# Altium project rt10-r2.PrjPcb (part 1 of 2)
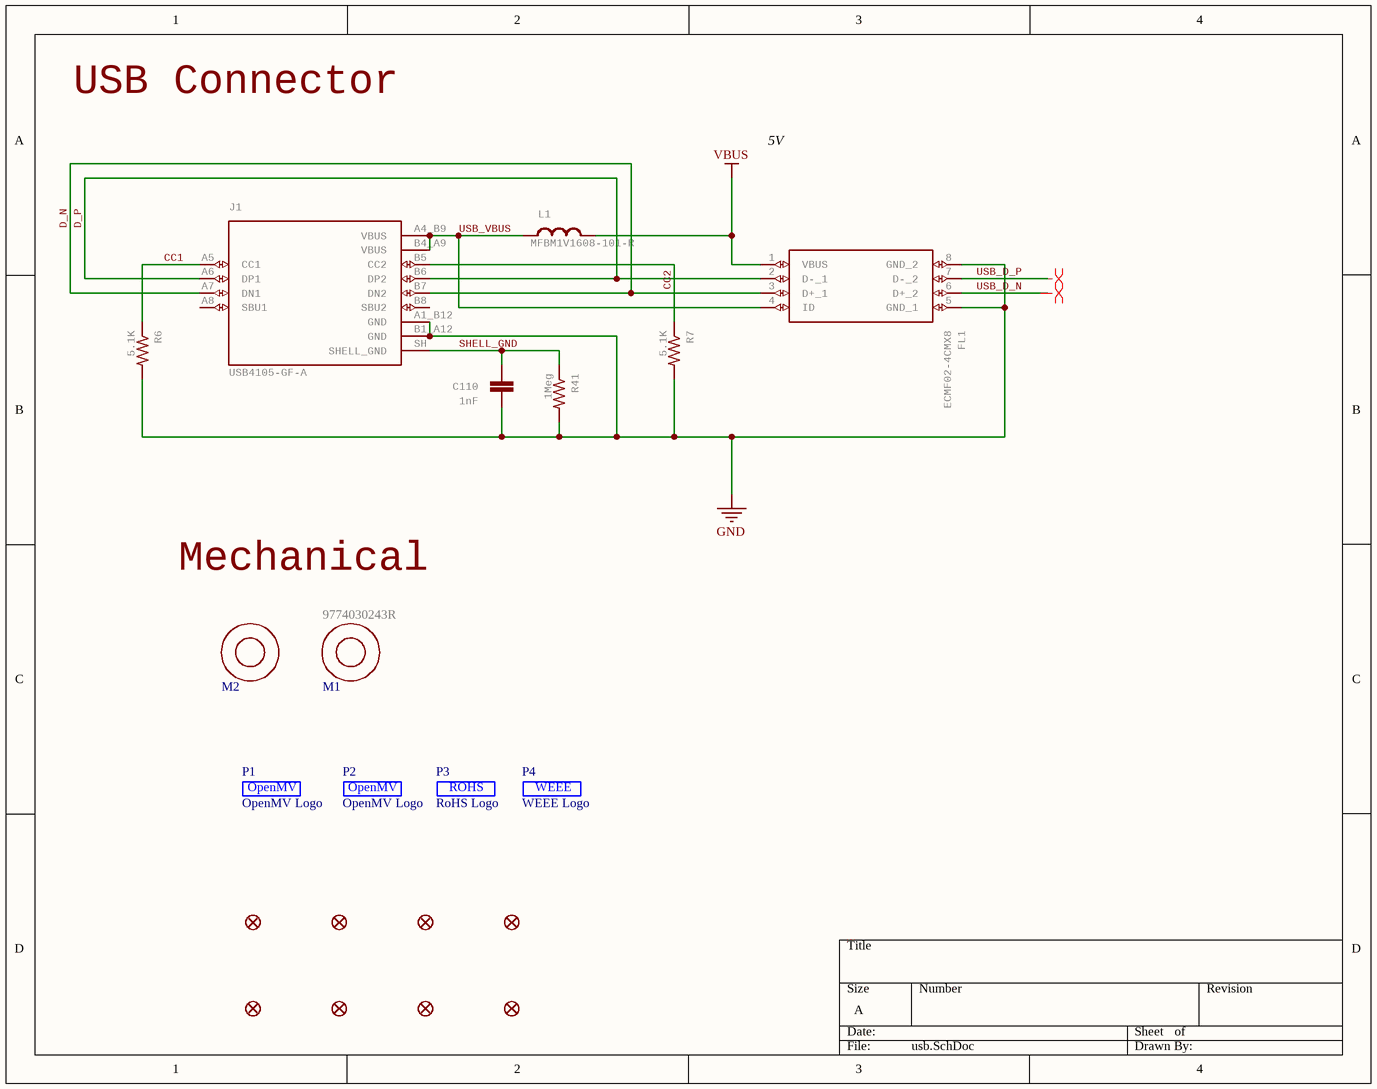
[diagram p0: usb.SchDoc]
14 sheets, 256 parts. Net scope: global (net labels, ports and power ports of the same name join across sheets).
Board file: rt10-r2.PcbDoc
Sheets:
  usb.SchDoc
  ideal-diode.SchDoc
  battery-charging.SchDoc
  regulators.SchDoc
  sdram-16-bit.SchDoc
  qspi-flash.SchDoc
  security-accelerometer.SchDoc
  sd-card.SchDoc
  sensor-header.SchDoc
  io-headers.SchDoc
  jtag.SchDoc
  ethernet.SchDoc
  wifi-bt.SchDoc
  mimxrt10xx.SchDoc

## Sheet usb.SchDoc
size A

### Parts
C110  1nF  [0402-CAP]
FD1  FIDUCIAL1X2  [FIDUCIAL-1X2]  (value not drawn)
FD2  FIDUCIAL1X2  [FIDUCIAL-1X2]  (value not drawn)
FD3  FIDUCIAL1X2  [FIDUCIAL-1X2]  (value not drawn)
FD4  FIDUCIAL1X2  [FIDUCIAL-1X2]  (value not drawn)
FD5  FIDUCIAL1X2  [FIDUCIAL-1X2]  (value not drawn)
FD6  FIDUCIAL1X2  [FIDUCIAL-1X2]  (value not drawn)
FD7  FIDUCIAL1X2  [FIDUCIAL-1X2]  (value not drawn)
FD8  FIDUCIAL1X2  [FIDUCIAL-1X2]  (value not drawn)
FL1  ECMF02-4CMX8  [ECMF024CMX8]
J1  USB4105-GF-A  [GCT_USB4105-GF-A]
L1  MFBM1V1608-101-R  [0603-RES]
M1  9774030243R  [9774030243R]
M2  9774030243R  [9774030243R]  (value not drawn)
P1  OpenMV Logo  [OMV-LOGO-SMALL]  (no BOM)
P2  OpenMV Logo  [OMV-LOGO-SMALL]  (no BOM)
P3  RoHS Logo  [ROHS]  (no BOM)
P4  WEEE Logo  [WEEE]  (no BOM)
R6  5.1K  [0402-RES]
R7  5.1K  [0402-RES]
R41  1Meg  [0402-RES]

### Nets
GND: C110.2 FL1.5(GND_1) FL1.8(GND_2) J1.A1_B12(GND) J1.B1_A12(GND) R6.2 R7.2 R41.2
VBUS: FL1.1(VBUS) L1.2
CC1: J1.A5(CC1) R6.1
CC2: J1.B5(CC2) R7.1
D_N: FL1.3(D+_1) J1.A7(DN1) J1.B7(DN2)
D_P: FL1.2(D-_1) J1.A6(DP1) J1.B6(DP2)
SHELL_GND: C110.1 J1.SH(SHELL_GND) R41.1
USB_D_N: FL1.6(D+_2)
USB_D_P: FL1.7(D-_2)
USB_VBUS: FL1.4(ID) J1.A4_B9(VBUS) J1.B4_A9(VBUS) L1.1

Not connected (* = marked no-connect by the designer): J1 A8(SBU1) B8(SBU2)

### Layout directives
differential pair: USB_D_N, USB_D_P

### Notes on the sheet
- USB Connector
- 5V
- Mechanical
- (in symbol OMV) OpenMV

### Library data of the parts
C110 = CAP0402-CAP: Capacitor; MPN: VJ0402Y102JXACW1BC; GateName_1: G$1; SymbolName_1: CAP; DeviceName: 0402-CAP; LibraryName: sfe; DeviceSetName: CAP; Part Number: VJ0402Y102JXACW1BC
FD1-FD8 = FIDUCIAL1X2: Fiducial Alignment Points    Point-of-reference for pick-and-place machines and other optical instruments.; GateName_1: G$1; DeviceName: 1X2; SymbolName_1: FIDUCIAL; LibraryName: SparkFun-Aesthetics; DeviceSetName: FIDUCIAL
FL1 = ECMF02-4CMX8: Common Mode Filter & ESD Prot. USB uQFN8 STMicroelectronics ECMF02 Series, Signal Filter uQFN SMD, Flat Contact Termination, 2.6 x 1.3 x 0.6mm   Source:  Datasheet; GateName_1: G$1; SymbolName_1: ECMF02-4CMX8; LibraryName: ECMF02-4CMX8; DeviceSetName: ECMF02-4CMX8; HEIGHT: mm; MANUFACTURER_NAME: STMicroelectronics; MANUFACTURER_PART_NUMBER: ECMF02-4CMX8; MOUSER_PART_NUMBER: 511-ECMF02-4CMX8; MOUSER_PRICE-STOCK: https://www.mouser.co.uk/ProductDetail/STMicroelectronics/ECMF02-4CMX8?qs=xYt8xtm2zhmK7GoDlDZR3A%3D%3D; MPN: ECMF02-4CMX8; Part Number: ECMF02-4CMX8
J1 = USB4105-GF-A: USB-C (USB TYPE-C) USB 2.0 Receptacle Connector 24 (16+8 Dummy) Position Surface Mount, Right Angle; Through Hole  Check availability; GateName_1: G$1; MF: GCT; SymbolName_1: USB4105-GF-A; LibraryName: USB4105-GF-A; DeviceSetName: USB4105-GF-A; AVAILABILITY: In Stock; MP: USB4105-GF-A; MPN: USB4105-GF-A; PACKAGE: None; PRICE: None; PURCHASE-URL: https://pricing.snapeda.com/search/part/USB4105-GF-A/?ref=eda; Part Number: USB4105-GF-A
L1 = INDUCTOR: InductorsBasic Inductor/Choke - 0603 and 1206. Footprints are not proven and vary greatly between part numbers.; GateName_1: G$1; MPN: MFBM1V1608-101-R; Part Number: MFBM1V1608-101-R
M1 M2 = 9774030243R: M2 3mm Standoff; GateName_1: G$1; SymbolName_1: 9774030243R; LibraryName: 9774030243R; DeviceSetName: 9774030243R; MPN: 9774030243R; Part Number: 9774030243R
P1 P2 = OMV
P3 = ROHS
P4 = WEEE
R6 R7 = RESISTOR0402-RES: ResistorBasic schematic elements and footprints for 0603, 1206, and PTH resistors.; MPN: RC0402JR-075K1L; GateName_1: G$1; SymbolName_1: RESISTOR; DeviceName: 0402-RES; LibraryName: sfe; DeviceSetName: RESISTOR; Part Number: RC0402JR-075K1L
R41 = RESISTOR0402-RES: Resistor; MPN: CRCW04021M00FKEDC; GateName_1: G$1; SymbolName_1: RESISTOR; DeviceName: 0402-RES; LibraryName: sfe; DeviceSetName: RESISTOR; Part Number: CRCW04021M00FKEDC

## Sheet ideal-diode.SchDoc
size A
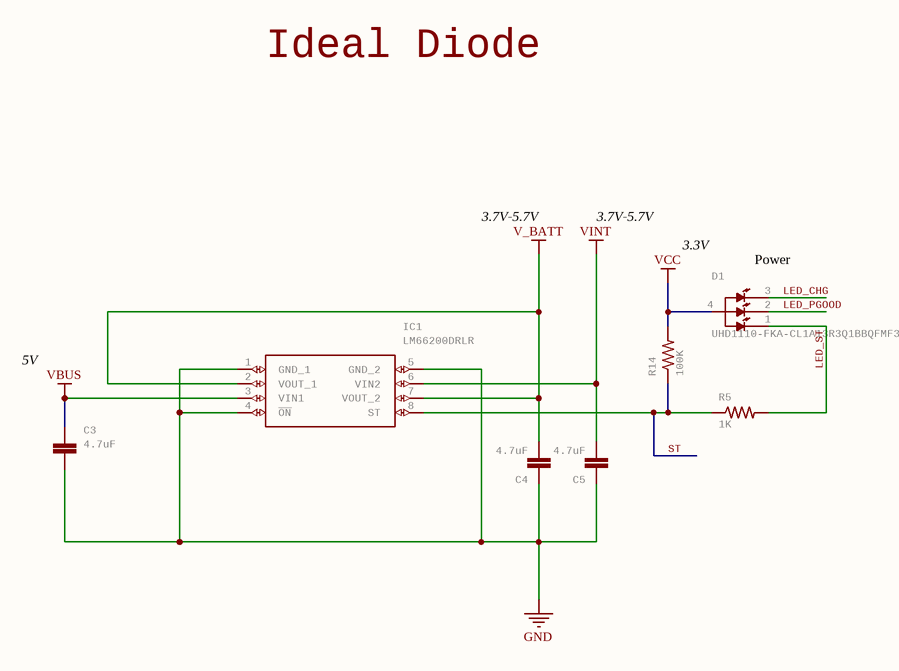
[diagram p1: ideal-diode.SchDoc]

### Parts
C3  4.7uF  [0402-CAP]
C4  4.7uF  [0402-CAP]
C5  4.7uF  [0402-CAP]
D1  UHD1110-FKA-CL1A13R3Q1BBQFMF3  [LED_UHD1110-FKA-CL1A13R3Q1BBQFMF3]
IC1  LM66200DRLR  [SOTFL50P160X60-8N]
R5  1K  [0402-RES]
R14  100K  [0402-RES]

### Nets
GND: C3.1 C4.1 C5.1 IC1.1(GND_1) IC1.4(~{ON}) IC1.5(GND_2)
V_BATT: C4.2 IC1.2(VOUT_1) IC1.7(VOUT_2)
VBUS: C3.2 IC1.3(VIN1)
VCC: D1.4(ANODE) R14.2
VINT: C5.2 IC1.6(VIN2)
LED_CHG: D1.3(RED)
LED_PGOOD: D1.2(GREEN)
LED_ST: D1.1(BLUE) R5.2
ST: IC1.8(ST) R5.1 R14.1

### Notes on the sheet
- Ideal Diode
- 3.7V-5.7V
- (near D1) 3.3V
- (near D1) Power
- 5V

### Library data of the parts
C3-C5 = CAP0402-CAP: CapacitorStandard 0603 ceramic capacitor, and 0.1" leaded capacitor.; MPN: JMK105BBJ475MV-F; GateName_1: G$1; SymbolName_1: CAP; DeviceName: 0402-CAP; LibraryName: sfe; DeviceSetName: CAP; Part Number: JMK105BBJ475MV-F
D1 = UHD1110-FKA-CL1A13R3Q1BBQFMF3: LED RGB SMD, SIZE 1 X 1 mm Check availability; GateName_1: G$1; MF: Cree Inc.; SymbolName_1: UHD1110-FKA-CL1A13R3Q1BBQFMF3; LibraryName: UHD1110-FKA-CL1A13R3Q1BBQFMF3; DeviceSetName: UHD1110-FKA-CL1A13R3Q1BBQFMF3; AVAILABILITY: In Stock; MP: UHD1110-FKA-CL1A13R3Q1BBQFMF3; MPN: UHD1110-FKA-CL1A13r3q1BBQFMF3; PACKAGE: 0404 Cree Inc.; PRICE: None; PURCHASE-URL: https://pricing.snapeda.com/search/part/UHD1110-FKA-CL1A13R3Q1BBQFMF3/?ref=eda; Part Number: UHD1110-FKA-CL1A13r3q1BBQFMF3
IC1 = LM66200DRLR: 1.6-V to 5.5-V, 40-m, 2.5-A, low-IQ, dual ideal diode   Source:  Datasheet; MANUFACTURER_NAME: Texas Instruments; GateName_1: G$1; SymbolName_1: LM66200DRLR; LibraryName: LM66200DRLR; DeviceSetName: LM66200DRLR; HEIGHT: 0.6mm; MANUFACTURER_PART_NUMBER: LM66200DRLR; MOUSER_PART_NUMBER: 595-LM66200DRLR; MOUSER_PRICE-STOCK: https://www.mouser.co.uk/ProductDetail/Texas-Instruments/LM66200DRLR?qs=Rp5uXu7WBW90hnpZAkIOdQ%3D%3D; MPN: LM66200DRLR; Part Number: LM66200DRLR
R5 = RESISTOR0402-RES: ResistorBasic schematic elements and footprints for 0603, 1206, and PTH resistors.; MPN: CRCW04021K00FKEDC; GateName_1: G$1; SymbolName_1: RESISTOR; DeviceName: 0402-RES; LibraryName: sfe; DeviceSetName: RESISTOR; Part Number: CRCW04021K00FKEDC
R14 = RESISTOR0402-RES: ResistorBasic schematic elements and footprints for 0603, 1206, and PTH resistors.; MPN: AC0402FR-07100KL; GateName_1: G$1; SymbolName_1: RESISTOR; DeviceName: 0402-RES; LibraryName: sfe; DeviceSetName: RESISTOR; Part Number: AC0402FR-07100KL

## Sheet battery-charging.SchDoc
size A
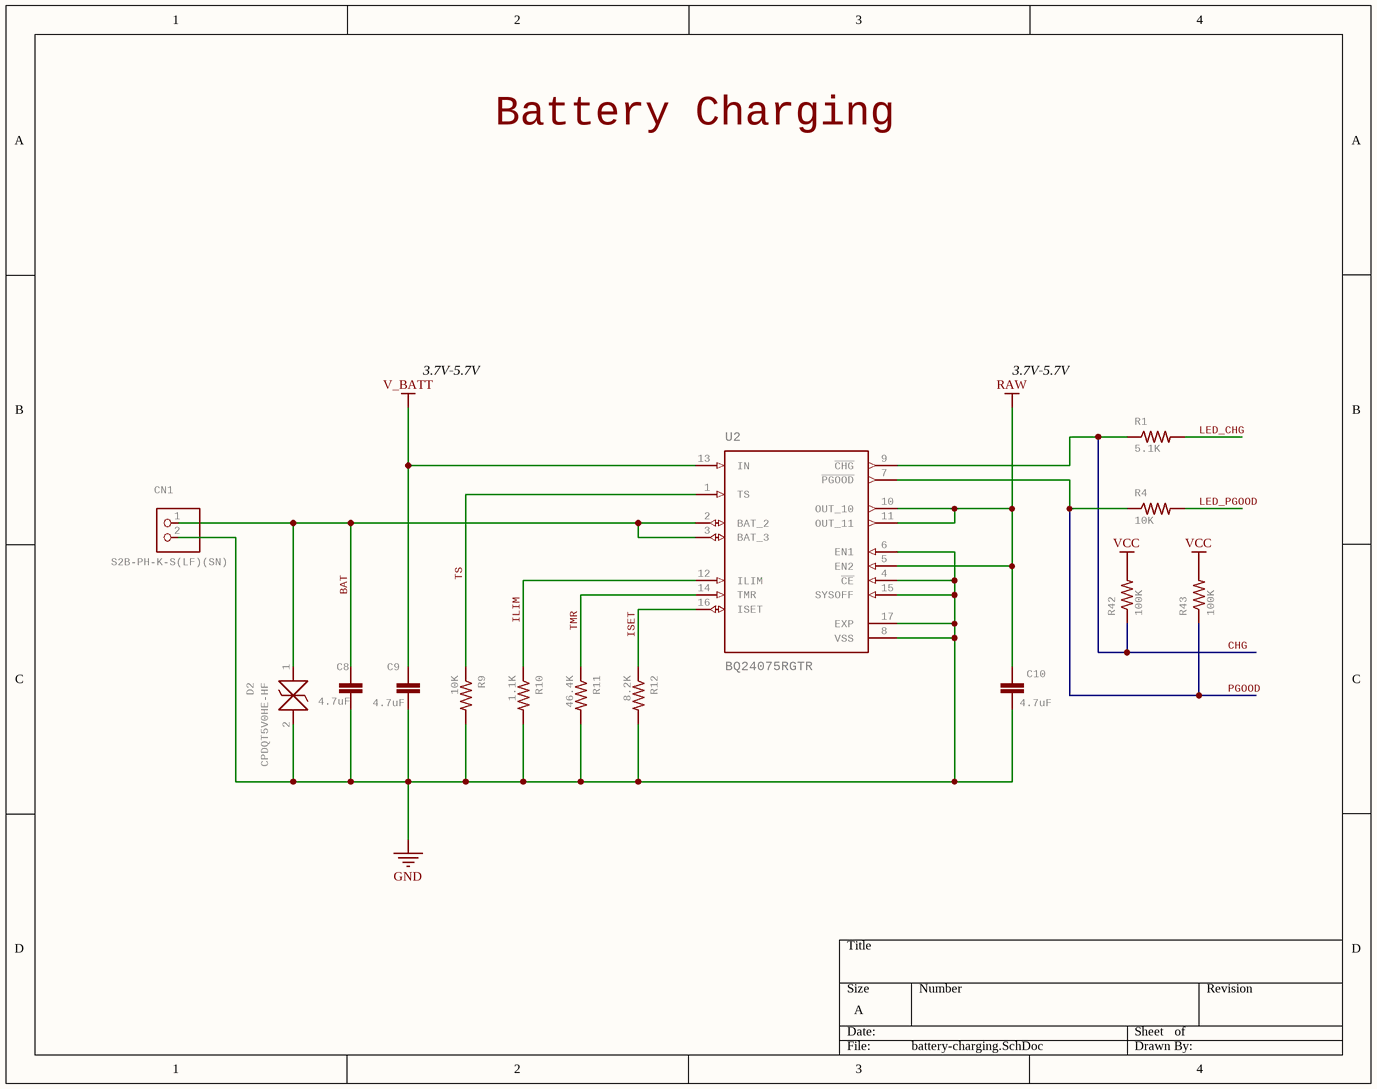
[diagram p2: battery-charging.SchDoc]

### Parts
C8  4.7uF  [0402-CAP]
C9  4.7uF  [0402-CAP]
C10  4.7uF  [0402-CAP]
CN1  S2B-PH-K-S(LF)(SN)  [JST-PH-2-THM-RA]
D2  CPDQT5V0HE-HF  [CPDQT5V0HEHF]
R1  5.1K  [0402-RES]
R4  10K  [0402-RES]
R9  10K  [0402-RES]
R10  1.1K  [0402-RES]
R11  46.4K  [0402-RES]
R12  8.2K  [0402-RES]
R42  100K  [0402-RES]
R43  100K  [0402-RES]
U2  BQ24075RGTR  [QFN50P300X300X100-17N]

### Nets
GND: C8.1 C9.1 C10.1 CN1.2 D2.2 R9.2 R10.2 R11.2 R12.2 U2.4(~{CE}) U2.6(EN1) U2.8(VSS) U2.15(SYSOFF) U2.17(EXP)
RAW: C10.2 U2.5(EN2) U2.10(OUT_10) U2.11(OUT_11)
V_BATT: C9.2 U2.13(IN)
VCC: R42.2 R43.2
BAT: C8.2 CN1.1 D2.1 U2.2(BAT_2) U2.3(BAT_3)
CHG: R1.1 R42.1 U2.9(~{CHG})
ILIM: R10.1 U2.12(ILIM)
ISET: R12.1 U2.16(ISET)
LED_CHG: R1.2
LED_PGOOD: R4.2
PGOOD: R4.1 R43.1 U2.7(~{PGOOD})
TMR: R11.1 U2.14(TMR)
TS: R9.1 U2.1(TS)

### Notes on the sheet
- Battery Charging
- 3.7V-5.7V

### Library data of the parts
C8-C10 = CAP0402-CAP: as C3 on sheet ideal-diode; DeviceName: 0402-CAP; LibraryName: sfe; DeviceSetName: CAP; Part Number: JMK105BBJ475MV-F
CN1 = JST_2PIN-THM-RA: JST 2-Pin Connectors of various flavors SMT-RA (S2B-PH-SM4) 4UConnector #17311  SMT  (B2B-PH-SM4)  THM-RA (S2B-PH)  THM  (B2B-PH); GateName_1: G$1; SymbolName_1: PINHD2; DeviceName: -THM-RA; LibraryName: adafruit-updated; DeviceSetName: JST_2PIN; MPN: S2B-PH-K-S(LF)(SN); Part Number: S2B-PH-K-S(LF)(SN)
D2 = CPDQT5V0HE-HF: ESD Suppressors / TVS Diodes DIODE ESD 5VWM 65W 0402/SOD-923F   Source:  Datasheet; MANUFACTURER_NAME: Comchip Technology; GateName_1: G$1; SymbolName_1: CPDQT5V0HE-HF; LibraryName: CPDQT5V0HE-HF; DeviceSetName: CPDQT5V0HE-HF; HEIGHT: 0.42mm; MANUFACTURER_PART_NUMBER: CPDQT5V0HE-HF; MOUSER_PART_NUMBER: MOUSER_PART_NUMBER; MOUSER_PRICE-STOCK: MOUSER_PRICE-STOCK; MPN: CPDQT5V0HE-HF; Part Number: CPDQT5V0HE-HF
R1 = RESISTOR0402-RES: as R6 on sheet usb; SymbolName_1: RESISTOR; DeviceName: 0402-RES; LibraryName: sfe; DeviceSetName: RESISTOR; Part Number: RC0402JR-075K1L
R4 R9 = RESISTOR0402-RES: ResistorBasic schematic elements and footprints for 0603, 1206, and PTH resistors.; MPN: AC0402FR-1310KL; GateName_1: G$1; SymbolName_1: RESISTOR; DeviceName: 0402-RES; LibraryName: sfe; DeviceSetName: RESISTOR; Part Number: AC0402FR-1310KL
R10 = RESISTOR0402-RES: ResistorBasic schematic elements and footprints for 0603, 1206, and PTH resistors.; MPN: RC0402JR-071K1; GateName_1: G$1; SymbolName_1: RESISTOR; DeviceName: 0402-RES; LibraryName: sfe; DeviceSetName: RESISTOR; Part Number: RC0402JR-071K1
R11 = RESISTOR0402-RES: ResistorBasic schematic elements and footprints for 0603, 1206, and PTH resistors.; MPN: WR04X4642FTL; GateName_1: G$1; SymbolName_1: RESISTOR; DeviceName: 0402-RES; LibraryName: sfe; DeviceSetName: RESISTOR; Part Number: WR04X4642FTL
R12 = RESISTOR0402-RES: ResistorBasic schematic elements and footprints for 0603, 1206, and PTH resistors.; MPN: CR0402-FX-8201GLF; GateName_1: G$1; SymbolName_1: RESISTOR; DeviceName: 0402-RES; LibraryName: sfe; DeviceSetName: RESISTOR; Part Number: CR0402-FX-8201GLF
R42 R43 = RESISTOR0402-RES: as R14 on sheet ideal-diode; SymbolName_1: RESISTOR; DeviceName: 0402-RES; LibraryName: sfe; DeviceSetName: RESISTOR; Part Number: AC0402FR-07100KL
U2 = BQ24075RGTR: Standalone 1-cell 1.5-A linear charger, Power Path, 4.2-V VBAT and 5.5-V VOUT 16-VQFN -40 to 85  Check availability; GateName_1: G$1; MF: Texas Instruments; SymbolName_1: BQ24075RGTR; LibraryName: BQ24075RGTR; DeviceSetName: BQ24075RGTR; AVAILABILITY: In Stock; MP: BQ24075RGTR; MPN: BQ24075RGTR; PACKAGE: VQFN-16 Texas Instruments; PRICE: None; PURCHASE-URL: https://pricing.snapeda.com/search/part/BQ24075RGTR/?ref=eda; Part Number: BQ24075RGTR

## Sheet regulators.SchDoc
size A
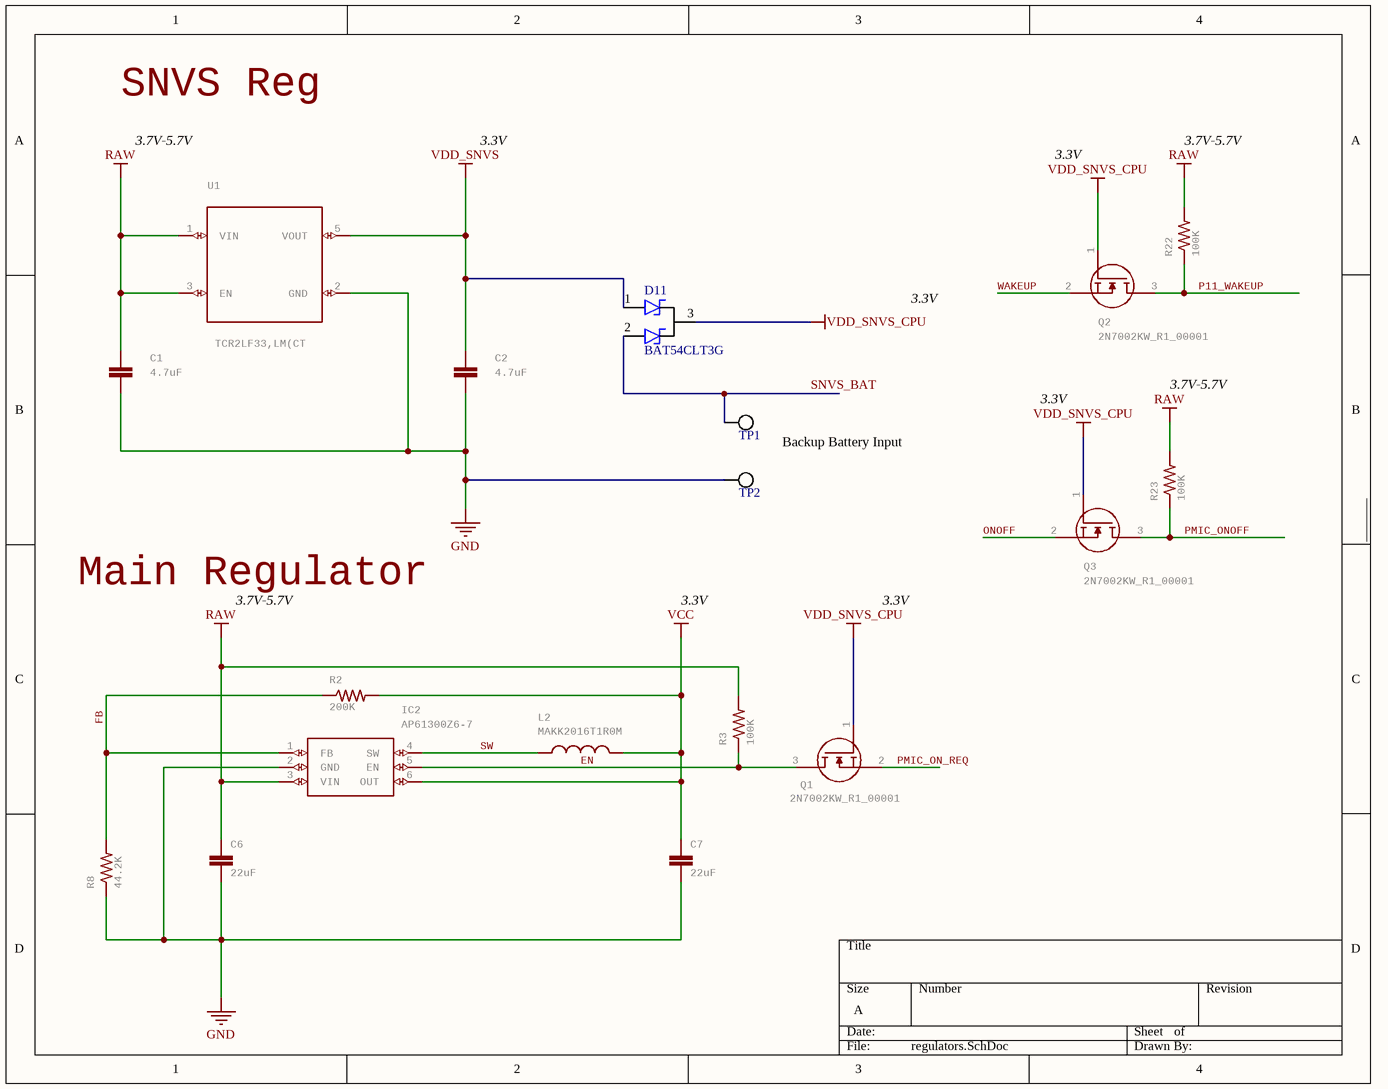
[diagram p3: regulators.SchDoc]

### Parts
C1  4.7uF  [0402-CAP]
C2  4.7uF  [0402-CAP]
C6  22uF  [0805]
C7  22uF  [0805]
D11  MPN: BAT54CLT3G  [SOT-23-3]  (hidden comment: Dual Schottky)
IC2  AP61300Z6-7  [SOTFL50P162X60-6N]
L2  MAKK2016T1R0M  [INDC2016X100N]
Q1  2N7002KW_R1_00001  [SOT65P210X110-3N]
Q2  2N7002KW_R1_00001  [SOT65P210X110-3N]
Q3  2N7002KW_R1_00001  [SOT65P210X110-3N]
R2  200K  [0402-RES]
R3  100K  [0402-RES]
R8  44.2K  [0402-RES]
R22  100K  [0402-RES]
R23  100K  [0402-RES]
TP1  TP  [TP_1p8]  (value not drawn)  (no BOM)
TP2  TP  [TP_1p8]  (value not drawn)  (no BOM)
U1  TCR2LF33,LM(CT  [SOT-23-5]

### Nets
GND: C1.1 C2.1 C6.2 C7.2 IC2.2(GND) R8.1 TP2.1 U1.2(GND)
RAW: C1.2 C6.1 IC2.3(VIN) R3.2 R22.2 R23.2 U1.1(VIN) U1.3(EN)
VCC: C7.1 IC2.6(OUT) L2.2 R2.2
VDD_SNVS: C2.2 D11.1 U1.5(VOUT)
VDD_SNVS_CPU: D11.3 Q1.1(G) Q2.1(G) Q3.1(G)
EN: IC2.5(EN) Q1.3(D) R3.1
FB: IC2.1(FB) R2.1 R8.2
ONOFF: Q3.2(S)
P11_WAKEUP: Q2.3(D) R22.1
PMIC_ON_REQ: Q1.2(S)
PMIC_ONOFF: Q3.3(D) R23.1
SNVS_BAT: D11.2 TP1.1
SW: IC2.4(SW) L2.1
WAKEUP: Q2.2(S)

### Notes on the sheet
- SNVS Reg
- 3.7V-5.7V
- 3.3V
- Backup Battery Input
- Main Regulator

### Library data of the parts
C1 C2 = CAP0402-CAP: as C3 on sheet ideal-diode; DeviceName: 0402-CAP; LibraryName: sfe; DeviceSetName: CAP; Part Number: JMK105BBJ475MV-F
C6 C7 = 22UF-0805-6.3V-20%: 22ÂµF ceramic capacitors    A capacitor is a passive two-terminal electrical component used to store electrical energy temporarily in an electric field.; MPN: CL21A226MQQNNNE; GateName_1: G$1; SymbolName_1: CAP; PROD_ID: CAP-08402; DeviceName: -0805-6.3V-20%; LibraryName: SparkFun-Capacitors; DeviceSetName: 22UF; Part Number: CL21A226MQQNNNE
D11 = Dual Schottky: Value: ?V; Part Number: BAT54CLT3G
IC2 = AP61300Z6-7: DCDC Conv LV Buck SOT563 T&R 3K   Source:  Datasheet; MANUFACTURER_NAME: Diodes Inc.; GateName_1: G$1; SymbolName_1: AP61300Z6-7; LibraryName: AP61300Z6-7; DeviceSetName: AP61300Z6-7; HEIGHT: 0.6mm; MANUFACTURER_PART_NUMBER: AP61300Z6-7; MOUSER_PART_NUMBER: 621-AP61300Z6-7; MOUSER_PRICE-STOCK: https://www.mouser.co.uk/ProductDetail/Diodes-Incorporated/AP61300Z6-7?qs=HBWAp0VN4Ri0dzb0XP2pEA%3D%3D; MPN: AP61300Z6-7; Part Number: AP61300Z6-7
L2 = MAKK2016T1R0M: Ind Power Wirewound 1uH 20% 2MHz Metal 2200mA 0806 Check availability; GateName_1: G$1; MF: Taiyo Yuden; SymbolName_1: MAKK2016T1R0M; LibraryName: MAKK2016T1R0M; DeviceSetName: MAKK2016T1R0M; AVAILABILITY: In Stock; MP: MAKK2016T1R0M; MPN: MAKK2016T1R0M; PACKAGE: 2016 Taiyo Yuden; PRICE: None; PURCHASE-URL: https://pricing.snapeda.com/search/part/MAKK2016T1R0M/?ref=eda; Part Number: MAKK2016T1R0M
Q1-Q3 = 2N7002KW_R1_00001: MOSFET 60V N-Channel Enhancement Mode MOSFET - ESD Protected   Source:  Datasheet; MANUFACTURER_NAME: PANJIT; GateName_1: G$1; SymbolName_1: 2N7002KW_R1_00001; LibraryName: 2N7002KW_R1_00001; DeviceSetName: 2N7002KW_R1_00001; HEIGHT: 1.1mm; MANUFACTURER_PART_NUMBER: 2N7002KW_R1_00001; MOUSER_PART_NUMBER: 241-2N7002KWR100001; MOUSER_PRICE-STOCK: https://www.mouser.co.uk/ProductDetail/Panjit/2N7002KW_R1_00001?qs=sPbYRqrBIVliWKATqv7jNA%3D%3D; MPN: 2N7002KW_R1_00001; Part Number: 2N7002KW_R1_00001
R2 = RESISTOR0402-RES: ResistorBasic schematic elements and footprints for 0603, 1206, and PTH resistors.; MPN: CRCW0402200KFKEDC; GateName_1: G$1; SymbolName_1: RESISTOR; DeviceName: 0402-RES; LibraryName: sfe; DeviceSetName: RESISTOR; Part Number: CRCW0402200KFKEDC
R3 R22 R23 = RESISTOR0402-RES: as R14 on sheet ideal-diode; SymbolName_1: RESISTOR; DeviceName: 0402-RES; LibraryName: sfe; DeviceSetName: RESISTOR; Part Number: AC0402FR-07100KL
R8 = RESISTOR0402-RES: ResistorBasic schematic elements and footprints for 0603, 1206, and PTH resistors.; MPN: AC0402FR-0744K2L; GateName_1: G$1; SymbolName_1: RESISTOR; DeviceName: 0402-RES; LibraryName: sfe; DeviceSetName: RESISTOR; Part Number: AC0402FR-0744K2L
U1 = TCR2LF33,LM(CT: GateName_1: G$1; SymbolName_1: TCR2LF33,LM(CT; LibraryName: TCR2LF33,LM(CT; DeviceSetName: TCR2LF33,LM(CT; MPN: TCR2LF33,LM(CT

## Sheet sdram-16-bit.SchDoc
size A
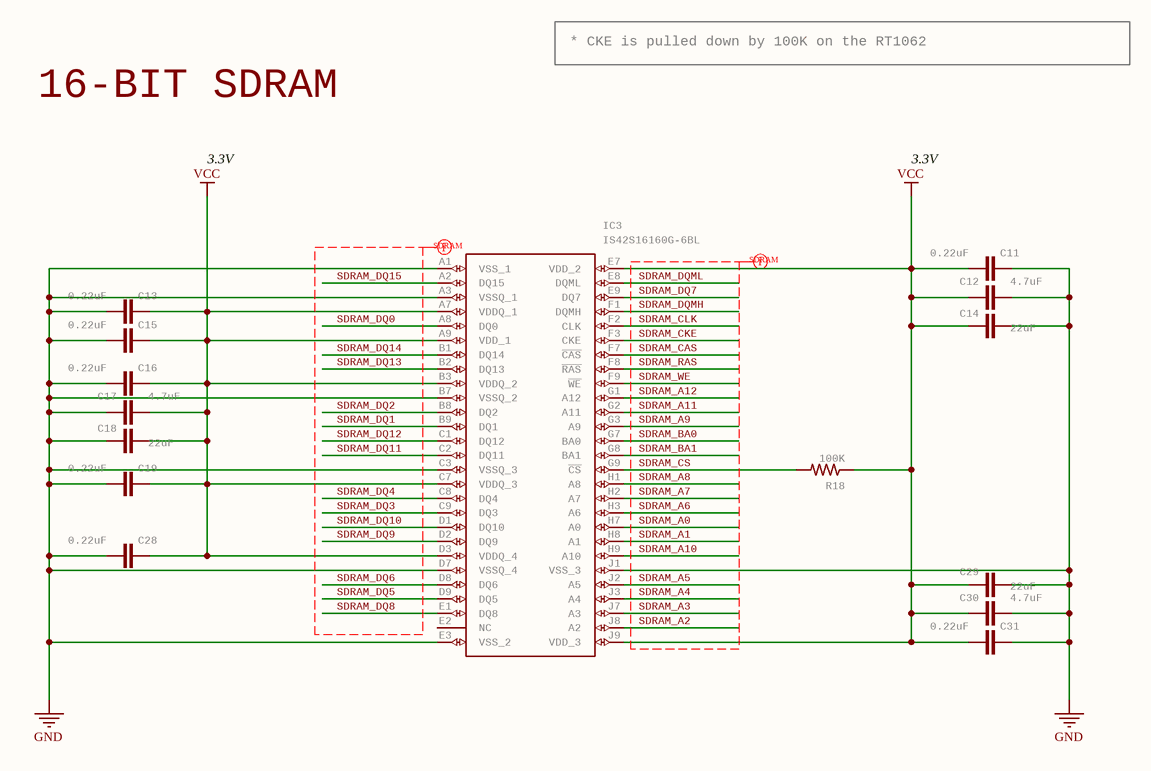
[diagram p4: sdram-16-bit.SchDoc]

### Parts
C11  0.22uF  [C0201]
C12  4.7uF  [0402-CAP]
C13  0.22uF  [C0201]
C14  22uF  [0805]
C15  0.22uF  [C0201]
C16  0.22uF  [C0201]
C17  4.7uF  [0402-CAP]
C18  22uF  [0805]
C19  0.22uF  [C0201]
C28  0.22uF  [C0201]
C29  22uF  [0805]
C30  4.7uF  [0402-CAP]
C31  0.22uF  [C0201]
IC3  IS42S16160G-6BL  [BGA54C80P9X9_800X800X120]
R18  100K  [0402-RES]

### Nets
GND: C11.1 C12.2 C13.2 C14.2 C15.2 C16.2 C17.1 C18.1 C19.2 C28.2 C29.2 C30.2 C31.1 IC3.A1(VSS_1) IC3.A3(VSSQ_1) IC3.B7(VSSQ_2) IC3.C3(VSSQ_3) IC3.D7(VSSQ_4) IC3.E3(VSS_2) IC3.J1(VSS_3)
VCC: C11.2 C12.1 C13.1 C14.1 C15.1 C16.1 C17.2 C18.2 C19.1 C28.1 C29.1 C30.1 C31.2 IC3.A7(VDDQ_1) IC3.A9(VDD_1) IC3.B3(VDDQ_2) IC3.C7(VDDQ_3) IC3.D3(VDDQ_4) IC3.E7(VDD_2) IC3.J9(VDD_3) R18.1
SDRAM_A0: IC3.H7(A0)
SDRAM_A1: IC3.H8(A1)
SDRAM_A2: IC3.J8(A2)
SDRAM_A3: IC3.J7(A3)
SDRAM_A4: IC3.J3(A4)
SDRAM_A5: IC3.J2(A5)
SDRAM_A6: IC3.H3(A6)
SDRAM_A7: IC3.H2(A7)
SDRAM_A8: IC3.H1(A8)
SDRAM_A9: IC3.G3(A9)
SDRAM_A10: IC3.H9(A10)
SDRAM_A11: IC3.G2(A11)
SDRAM_A12: IC3.G1(A12)
SDRAM_BA0: IC3.G7(BA0)
SDRAM_BA1: IC3.G8(BA1)
SDRAM_CAS: IC3.F7(~{CAS})
SDRAM_CKE: IC3.F3(CKE)
SDRAM_CLK: IC3.F2(CLK)
SDRAM_CS: IC3.G9(~{CS}) R18.2
SDRAM_DQ0: IC3.A8(DQ0)
SDRAM_DQ1: IC3.B9(DQ1)
SDRAM_DQ2: IC3.B8(DQ2)
SDRAM_DQ3: IC3.C9(DQ3)
SDRAM_DQ4: IC3.C8(DQ4)
SDRAM_DQ5: IC3.D9(DQ5)
SDRAM_DQ6: IC3.D8(DQ6)
SDRAM_DQ7: IC3.E9(DQ7)
SDRAM_DQ8: IC3.E1(DQ8)
SDRAM_DQ9: IC3.D2(DQ9)
SDRAM_DQ10: IC3.D1(DQ10)
SDRAM_DQ11: IC3.C2(DQ11)
SDRAM_DQ12: IC3.C1(DQ12)
SDRAM_DQ13: IC3.B2(DQ13)
SDRAM_DQ14: IC3.B1(DQ14)
SDRAM_DQ15: IC3.A2(DQ15)
SDRAM_DQMH: IC3.F1(DQMH)
SDRAM_DQML: IC3.E8(DQML)
SDRAM_RAS: IC3.F8(~{RAS})
SDRAM_WE: IC3.F9(~{WE})

Not connected (* = marked no-connect by the designer): IC3 E2(NC)

### Layout directives
net class SDRAM: SDRAM_A0, SDRAM_A1, SDRAM_A2, SDRAM_A3, SDRAM_A4, SDRAM_A5, SDRAM_A6, SDRAM_A7, SDRAM_A8, SDRAM_A9, SDRAM_A10, SDRAM_A11, SDRAM_A12, SDRAM_BA0, SDRAM_BA1, SDRAM_CAS, SDRAM_CKE, SDRAM_CLK, SDRAM_CS, SDRAM_DQ0, SDRAM_DQ1, SDRAM_DQ2, SDRAM_DQ3, SDRAM_DQ4, SDRAM_DQ5, SDRAM_DQ6, SDRAM_DQ7, SDRAM_DQ8, SDRAM_DQ9, SDRAM_DQ10, SDRAM_DQ11, SDRAM_DQ12, SDRAM_DQ13, SDRAM_DQ14, SDRAM_DQ15, SDRAM_DQMH, SDRAM_DQML, SDRAM_RAS, SDRAM_WE

### Notes on the sheet
- * CKE is pulled down by 100K on the RT1062
- 16-BIT SDRAM
- 3.3V

### Library data of the parts
C11 C13 C15 C16 C19 C28 C31 = C-EUC0201: CAPACITOR, European symbol; MPN: GRM033R60J224ME15D; GateName_1: G$1; SymbolName_1: C-EU; POPULARITY: 0; DeviceName: C0201; LibraryName: rcl; DeviceSetName: C-EU; SPICEPREFIX: C; Part Number: GRM033R60J224ME15D
C12 C17 C30 = CAP0402-CAP: as C3 on sheet ideal-diode; DeviceName: 0402-CAP; LibraryName: sfe; DeviceSetName: CAP; Part Number: JMK105BBJ475MV-F
C14 C18 C29 = 22UF-0805-6.3V-20%: as C6 on sheet regulators; DeviceName: -0805-6.3V-20%; LibraryName: SparkFun-Capacitors; DeviceSetName: 22UF; Part Number: CL21A226MQQNNNE
IC3 = IS42S16160G-6BL: DRAM 256M 16Mx16 166Mhz SDR SDRAM, 3.3V   Source:  Datasheet; MANUFACTURER_NAME: Integrated Silicon Solution Inc.; GateName_1: G$1; SymbolName_1: IS42S16160G-6BL; LibraryName: IS42S16160G-6BL; DeviceSetName: IS42S16160G-6BL; HEIGHT: 1.2mm; MANUFACTURER_PART_NUMBER: IS42S16160G-6BL; MOUSER_PART_NUMBER: 870-IS42S16160G-6BL; MOUSER_PRICE-STOCK: https://www.mouser.co.uk/ProductDetail/ISSI/IS42S16160G-6BL?qs=9hm%252BDT1Jr7yvZBhvmJyecQ%3D%3D; MPN: IS42S16160G-6BL; Part Number: IS42S16160G-6BL
R18 = RESISTOR0402-RES: as R14 on sheet ideal-diode; SymbolName_1: RESISTOR; DeviceName: 0402-RES; LibraryName: sfe; DeviceSetName: RESISTOR; Part Number: AC0402FR-07100KL

## Sheet qspi-flash.SchDoc
size A
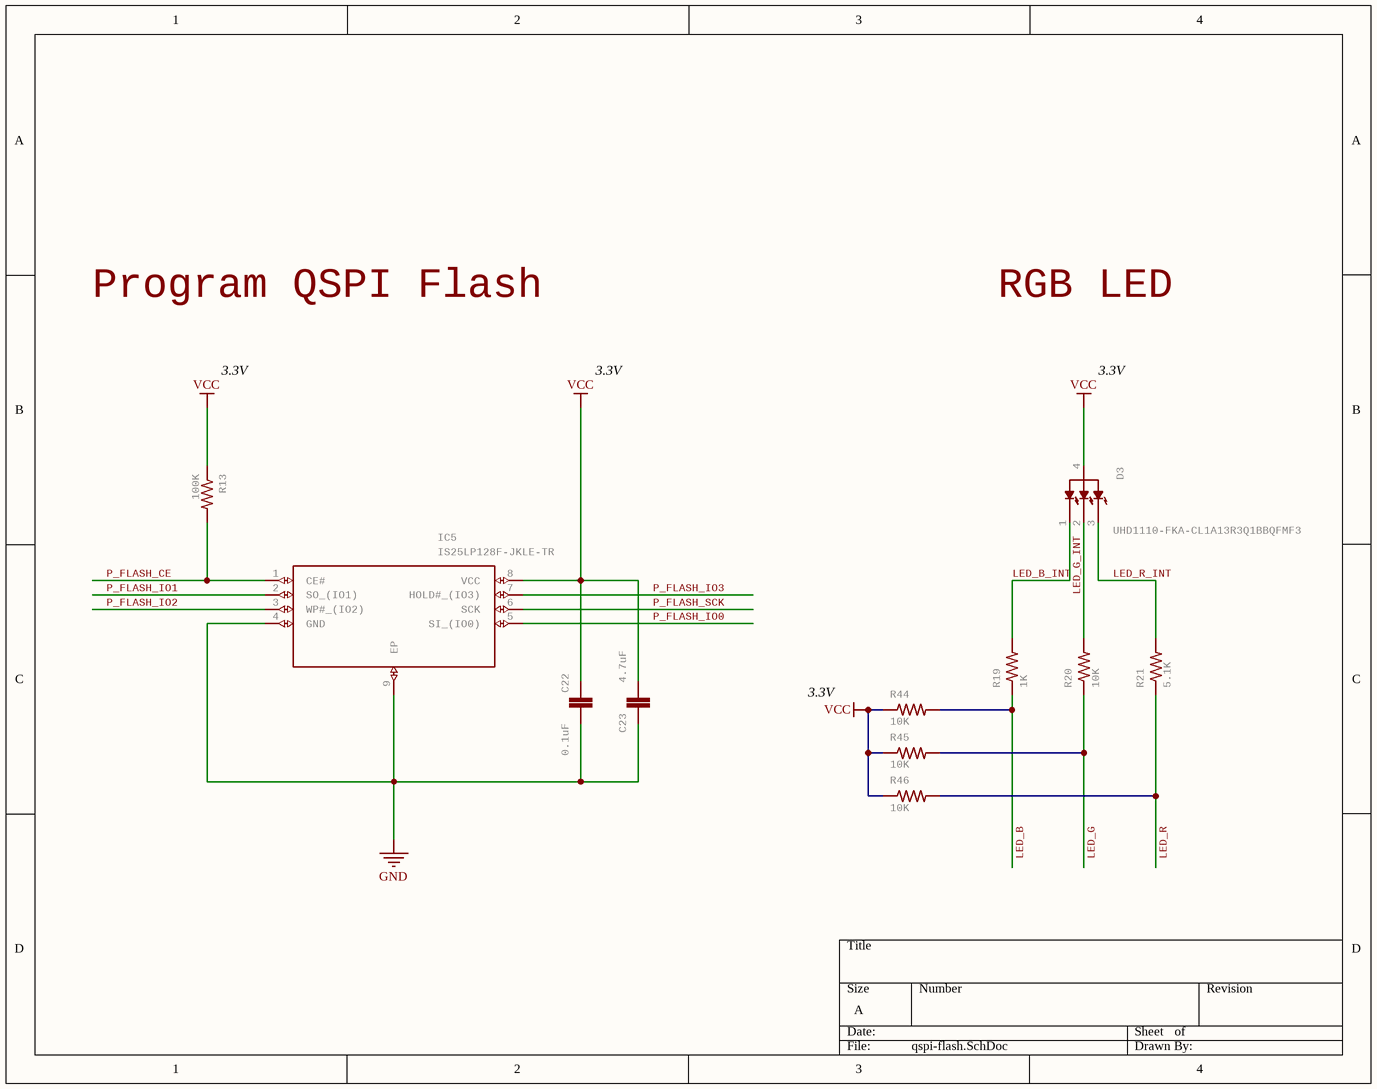
[diagram p5: qspi-flash.SchDoc]

### Parts
C22  0.1uF  [0402-CAP]
C23  4.7uF  [0402-CAP]
D3  UHD1110-FKA-CL1A13R3Q1BBQFMF3  [LED_UHD1110-FKA-CL1A13R3Q1BBQFMF3]
IC5  IS25LP128F-JKLE-TR  [SON127P500X595X80-9N]
R13  100K  [0402-RES]
R19  1K  [0402-RES]
R20  10K  [0402-RES]
R21  5.1K  [0402-RES]
R44  10K  [0402-RES]
R45  10K  [0402-RES]
R46  10K  [0402-RES]

### Nets
GND: C22.2 C23.1 IC5.4(GND) IC5.9(EP)
VCC: C22.1 C23.2 D3.4(ANODE) IC5.8(VCC) R13.1 R44.1 R45.1 R46.1
LED_B: R19.1 R44.2
LED_B_INT: D3.1(BLUE) R19.2
LED_G: R20.1 R45.2
LED_G_INT: D3.2(GREEN) R20.2
LED_R: R21.1 R46.2
LED_R_INT: D3.3(RED) R21.2
P_FLASH_CE: IC5.1(CE#) R13.2
P_FLASH_IO0: IC5.5(SI_(IO0))
P_FLASH_IO1: IC5.2(SO_(IO1))
P_FLASH_IO2: IC5.3(WP#_(IO2))
P_FLASH_IO3: IC5.7(HOLD#_(IO3))
P_FLASH_SCK: IC5.6(SCK)

### Notes on the sheet
- Program QSPI Flash
- RGB LED
- 3.3V

### Library data of the parts
C22 = C-EUC0201: CAPACITOR, European symbol; MPN: C0402C104Z4VAC; GateName_1: G$1; SymbolName_1: C-EU; POPULARITY: 0; LibraryName: rcl; DeviceSetName: C-EU; SPICEPREFIX: C; Part Number: C0402C104Z4VAC
C23 = CAP0402-CAP: as C3 on sheet ideal-diode; DeviceName: 0402-CAP; LibraryName: sfe; DeviceSetName: CAP; Part Number: JMK105BBJ475MV-F
D3 = UHD1110-FKA-CL1A13R3Q1BBQFMF3: as D1 on sheet ideal-diode; SymbolName_1: UHD1110-FKA-CL1A13R3Q1BBQFMF3; LibraryName: UHD1110-FKA-CL1A13R3Q1BBQFMF3; DeviceSetName: UHD1110-FKA-CL1A13R3Q1BBQFMF3; AVAILABILITY: In Stock; MP: UHD1110-FKA-CL1A13R3Q1BBQFMF3; MPN: UHD1110-FKA-CL1A13r3q1BBQFMF3; PACKAGE: 0404 Cree Inc.; PRICE: None; PURCHASE-URL: https://pricing.snapeda.com/search/part/UHD1110-FKA-CL1A13R3Q1BBQFMF3/?ref=eda; Part Number: UHD1110-FKA-CL1A13r3q1BBQFMF3
IC5 = IS25LP128F-JKLE-TR: NOR Flash 128M 2.3-3.6V 166Mhz Serial NOR Flash   Source:  Datasheet; MANUFACTURER_NAME: Integrated Silicon Solution Inc.; GateName_1: G$1; SymbolName_1: IS25LP128F-JKLE-TR; LibraryName: IS25LP128F-JKLE-TR; DeviceSetName: IS25LP128F-JKLE-TR; HEIGHT: 0.8mm; MANUFACTURER_PART_NUMBER: IS25LP128F-JKLE-TR; MOUSER_PART_NUMBER: 870-IS25LP128F-JKLE-TR; MOUSER_PRICE-STOCK: https://www.mouser.com/ProductDetail/ISSI/IS25LP128F-JKLE-TR?qs=F5EMLAvA7IC8MN2X519UUw%3D%3D&gclid=CjwKCAjwsvujBhAXEiwA_UXnABLUJpl9weydWRO2l8Lx1K-mg-pZDVt8AO_chLaXpBnEcozZukFcOxoCxuIQAvD_BwE; MPN: IS25LP128F-JKLE-TR
R13 = RESISTOR0402-RES: as R14 on sheet ideal-diode; SymbolName_1: RESISTOR; DeviceName: 0402-RES; LibraryName: sfe; DeviceSetName: RESISTOR; Part Number: AC0402FR-07100KL
R19 = RESISTOR0402-RES: as R5 on sheet ideal-diode; SymbolName_1: RESISTOR; DeviceName: 0402-RES; LibraryName: sfe; DeviceSetName: RESISTOR; Part Number: CRCW04021K00FKEDC
R20 R44-R46 = RESISTOR0402-RES: as R4 on sheet battery-charging; SymbolName_1: RESISTOR; DeviceName: 0402-RES; LibraryName: sfe; DeviceSetName: RESISTOR; Part Number: AC0402FR-1310KL
R21 = RESISTOR0402-RES: as R6 on sheet usb; SymbolName_1: RESISTOR; DeviceName: 0402-RES; LibraryName: sfe; DeviceSetName: RESISTOR; Part Number: RC0402JR-075K1L

## Sheet security-accelerometer.SchDoc
size A
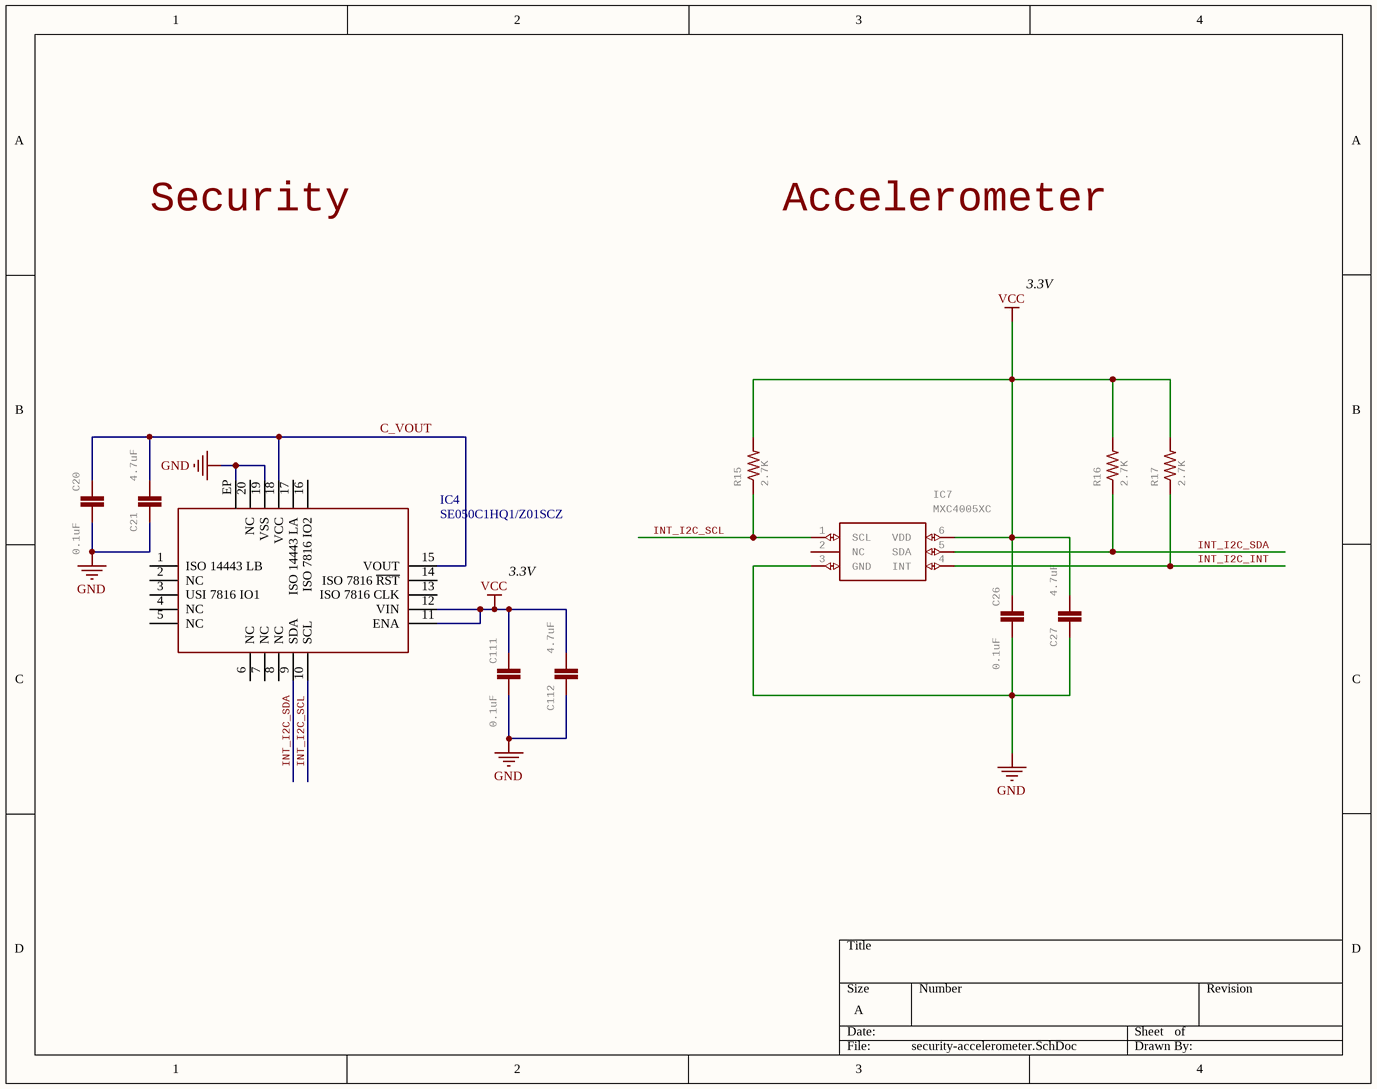
[diagram p6: security-accelerometer.SchDoc]

### Parts
C20  0.1uF  [0402-CAP]
C21  4.7uF  [0402-CAP]
C26  0.1uF  [0402-CAP]
C27  4.7uF  [0402-CAP]
C111  0.1uF  [0402-CAP]
C112  4.7uF  [0402-CAP]
IC4  SE050C1HQ1/Z01SCZ  [HX2QFN20]
IC7  MXC4005XC  [MXC4005XC]
R15  2.7K  [0402-RES]
R16  2.7K  [0402-RES]
R17  2.7K  [0402-RES]

### Nets
GND: C20.2 C21.1 C26.2 C27.1 C111.2 C112.1 IC4.19(VSS) IC4.EP IC7.3(GND)
VCC: C26.1 C27.2 C111.1 C112.2 IC4.11(ENA) IC4.12(VIN) IC7.6(VDD) R15.2 R16.2 R17.2
C_VOUT: C20.1 C21.2 IC4.15(VOUT) IC4.18(VCC)
INT_I2C_INT: IC7.4(INT) R17.1
INT_I2C_SCL: IC4.10(SCL) IC7.1(SCL) R15.1
INT_I2C_SDA: IC4.9(SDA) IC7.5(SDA) R16.1

Not connected (* = marked no-connect by the designer): IC4 1(ISO_14443_LB) 2(NC) 3(USI_7816_IO1) 4(NC) 5(NC) 6(NC) 7(NC) 8(NC) 13(ISO_7816_CLK) 14(ISO_7816_~{RST}) 16(ISO_7816_IO2) 17(ISO_14443_LA) 20(NC); IC7 2(NC)

### Notes on the sheet
- Security
- Accelerometer
- 3.3V

### Library data of the parts
C20 C26 C111 = C-EUC0201: as C22 on sheet qspi-flash; LibraryName: rcl; DeviceSetName: C-EU; SPICEPREFIX: C; Part Number: C0402C104Z4VAC
C21 C27 C112 = CAP0402-CAP: as C3 on sheet ideal-diode; DeviceName: 0402-CAP; LibraryName: sfe; DeviceSetName: CAP; Part Number: JMK105BBJ475MV-F
IC7 = MXC4005XC: Accelerometers Monolithic and Wafer Level Packaged Three-Axis Accelerometer   Source:  Datasheet; MANUFACTURER_NAME: MEMSIC; GateName_1: G$1; SymbolName_1: MXC4005XC; LibraryName: MXC4005XC; DeviceSetName: MXC4005XC; HEIGHT: 0.885mm; MANUFACTURER_PART_NUMBER: MXC4005XC; MOUSER_PART_NUMBER: 438-MXC4005XC; MOUSER_PRICE-STOCK: https://www.mouser.co.uk/ProductDetail/MEMSIC/MXC4005XC?qs=RcG8xmE7yp3iyYgWLmAtUw%3D%3D; MPN: MXC4005XC; Part Number: MXC4005XC
R15-R17 = RESISTOR0402-RES: ResistorBasic schematic elements and footprints for 0603, 1206, and PTH resistors.; MPN: AC0402JR-072K7L; GateName_1: G$1; SymbolName_1: RESISTOR; DeviceName: 0402-RES; LibraryName: sfe; DeviceSetName: RESISTOR; Part Number: AC0402JR-072K7L
IC4 = SE050C1HQ1/Z01SCZ: Part Number: SE050C1HQ1/Z01SCZ; MPN: SE050C1HQ1/Z01SCZ

## Sheet sd-card.SchDoc
size A
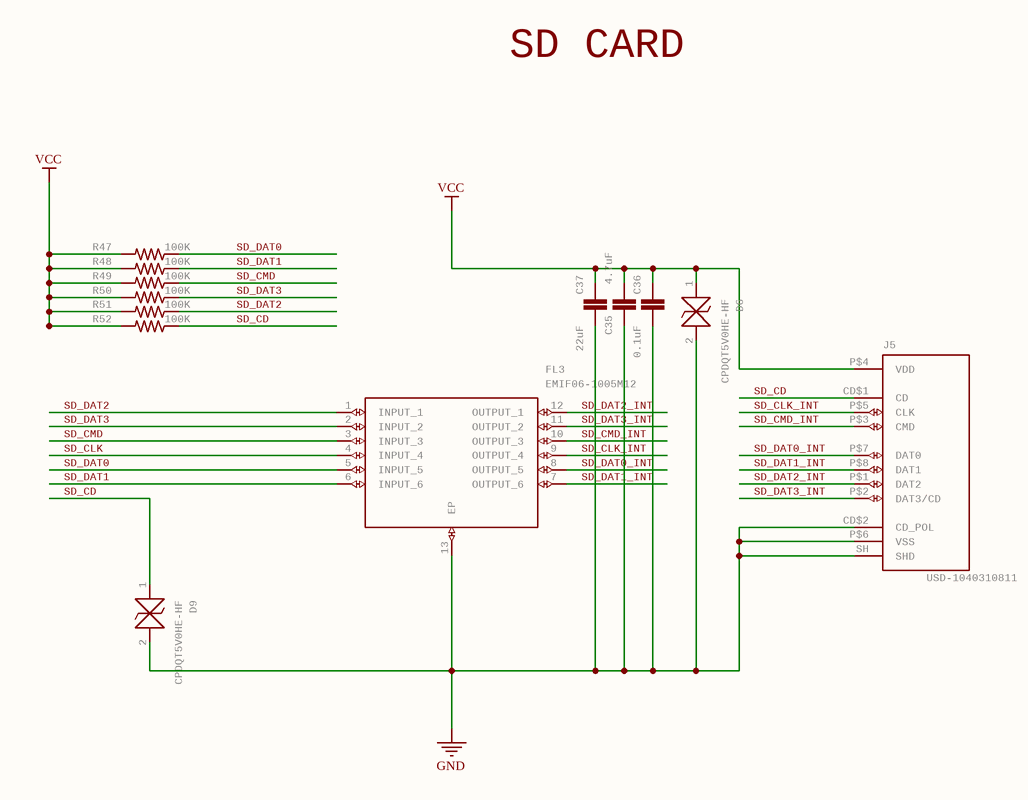
[diagram p7: sd-card.SchDoc]

### Parts
C35  4.7uF  [0402-CAP]
C36  0.1uF  [0402-CAP]
C37  22uF  [0805]
D6  CPDQT5V0HE-HF  [CPDQT5V0HEHF]
D9  CPDQT5V0HE-HF  [CPDQT5V0HEHF]
FL3  EMIF06-1005M12  [SON40P150X250X65-13N]
J5  USD-1040310811  [1040310811]
R47  100K  [0402-RES]
R48  100K  [0402-RES]
R49  100K  [0402-RES]
R50  100K  [0402-RES]
R51  100K  [0402-RES]
R52  100K  [0402-RES]

### Nets
GND: C35.1 C36.2 C37.2 D6.2 D9.2 FL3.13(EP) J5.CD$2(CD_POL) J5.P$6(VSS) J5.SH(SHD)
VCC: C35.2 C36.1 C37.1 D6.1 J5.P$4(VDD) R47.2 R48.2 R49.2 R50.2 R51.2 R52.2
SD_CD: D9.1 J5.CD$1(CD) R52.1
SD_CLK: FL3.4(INPUT_4)
SD_CLK_INT: FL3.9(OUTPUT_4) J5.P$5(CLK)
SD_CMD: FL3.3(INPUT_3) R49.1
SD_CMD_INT: FL3.10(OUTPUT_3) J5.P$3(CMD)
SD_DAT0: FL3.5(INPUT_5) R47.1
SD_DAT0_INT: FL3.8(OUTPUT_5) J5.P$7(DAT0)
SD_DAT1: FL3.6(INPUT_6) R48.1
SD_DAT1_INT: FL3.7(OUTPUT_6) J5.P$8(DAT1)
SD_DAT2: FL3.1(INPUT_1) R51.1
SD_DAT2_INT: FL3.12(OUTPUT_1) J5.P$1(DAT2)
SD_DAT3: FL3.2(INPUT_2) R50.1
SD_DAT3_INT: FL3.11(OUTPUT_2) J5.P$2(DAT3/CD)

### Notes on the sheet
- SD CARD

### Library data of the parts
C35 = CAP0402-CAP: as C3 on sheet ideal-diode; DeviceName: 0402-CAP; LibraryName: sfe; DeviceSetName: CAP; Part Number: JMK105BBJ475MV-F
C36 = C-EUC0201: as C22 on sheet qspi-flash; LibraryName: rcl; DeviceSetName: C-EU; SPICEPREFIX: C; Part Number: C0402C104Z4VAC
C37 = 22UF-0805-6.3V-20%: as C6 on sheet regulators; DeviceName: -0805-6.3V-20%; LibraryName: SparkFun-Capacitors; DeviceSetName: 22UF; Part Number: CL21A226MQQNNNE
D6 D9 = CPDQT5V0HE-HF: as D2 on sheet battery-charging; SymbolName_1: CPDQT5V0HE-HF; LibraryName: CPDQT5V0HE-HF; DeviceSetName: CPDQT5V0HE-HF; HEIGHT: 0.42mm; MANUFACTURER_PART_NUMBER: CPDQT5V0HE-HF; MOUSER_PART_NUMBER: MOUSER_PART_NUMBER; MOUSER_PRICE-STOCK: MOUSER_PRICE-STOCK; MPN: CPDQT5V0HE-HF; Part Number: CPDQT5V0HE-HF
FL3 = EMIF06-1005M12: EMI Filter Circuits 6lin lw cpcitnc EMI 45pF -35db @ 900MHz   Source:  Datasheet; MANUFACTURER_NAME: STMicroelectronics; GateName_1: G$1; SymbolName_1: EMIF06-1005M12; LibraryName: EMIF06-1005M12; DeviceSetName: EMIF06-1005M12; HEIGHT: 0.65mm; MANUFACTURER_PART_NUMBER: EMIF06-1005M12; MOUSER_PART_NUMBER: 511-EMIF06-1005M12; MOUSER_PRICE-STOCK: https://www.mouser.co.uk/ProductDetail/STMicroelectronics/EMIF06-1005M12?qs=VJaATVMq%252BXo0u09ZqtQg3A%3D%3D; MPN: EMIF06-1005M12; Part Number: EMIF06-1005M12
J5 = USD-1040310811: uSD Slot; MPN: 104031-0811; GateName_1: G$1; SymbolName_1: USD; LibraryName: 1040310811; DeviceSetName: USD-1040310811; Part Number: 104031-0811
R47-R52 = RESISTOR0402-RES: as R14 on sheet ideal-diode; SymbolName_1: RESISTOR; DeviceName: 0402-RES; LibraryName: sfe; DeviceSetName: RESISTOR; Part Number: AC0402FR-07100KL

## Sheet sensor-header.SchDoc
size A
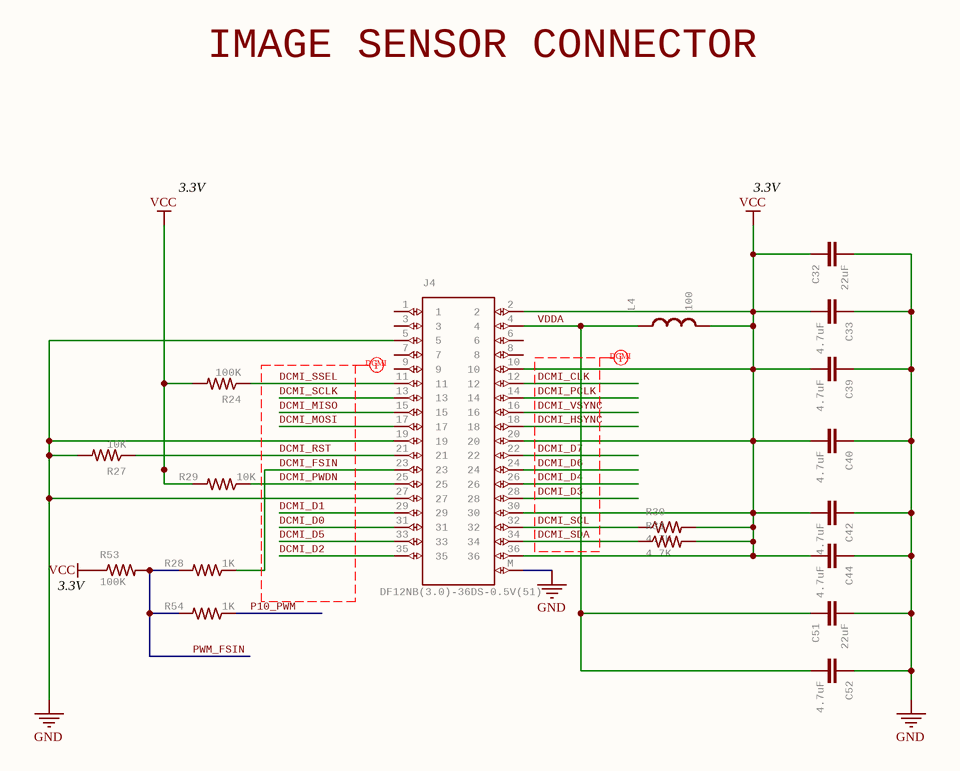
[diagram p8: sensor-header.SchDoc]

### Parts
C32  22uF  [0805]
C33  4.7uF  [0402-CAP]
C39  4.7uF  [0402-CAP]
C40  4.7uF  [0402-CAP]
C42  4.7uF  [0402-CAP]
C44  4.7uF  [0402-CAP]
C51  22uF  [0805]
C52  4.7uF  [0402-CAP]
J4  DF12NB(3.0)-36DS-0.5V(51)  [DF12-36-DS]
L4  100  [C0402]
R24  100K  [0402-RES]
R27  10K  [0402-RES]
R28  1K  [0402-RES]
R29  10K  [0402-RES]
R30  4.7K  [0402-RES]
R31  4.7K  [0402-RES]
R53  100K  [0402-RES]
R54  1K  [0402-RES]

### Nets
GND: C32.2 C33.1 C39.1 C40.1 C42.1 C44.1 C51.2 C52.1 J4.5 J4.19 J4.27 J4.M R27.2
VCC: C32.1 C33.2 C39.2 C40.2 C42.2 C44.2 J4.2 J4.10 J4.20 J4.30 J4.36 L4.2 R24.2 R29.2 R30.2 R31.2 R53.1
DCMI_CLK: J4.12
DCMI_D0: J4.31
DCMI_D1: J4.29
DCMI_D2: J4.35
DCMI_D3: J4.28
DCMI_D4: J4.26
DCMI_D5: J4.33
DCMI_D6: J4.24
DCMI_D7: J4.22
DCMI_FSIN: J4.23 R28.1
DCMI_HSYNC: J4.18
DCMI_MISO: J4.15
DCMI_MOSI: J4.17
DCMI_PCLK: J4.14
DCMI_PWDN: J4.25 R29.1
DCMI_RST: J4.21 R27.1
DCMI_SCL: J4.32 R30.1
DCMI_SCLK: J4.13
DCMI_SDA: J4.34 R31.1
DCMI_SSEL: J4.11 R24.1
DCMI_VSYNC: J4.16
P10_PWM: R54.1
PWM_FSIN: R28.2 R53.2 R54.2
VDDA: C51.1 C52.2 J4.4 L4.1

Not connected (* = marked no-connect by the designer): J4 1 3 6 7 8 9

### Layout directives
net class DCMI: DCMI_CLK, DCMI_D0, DCMI_D1, DCMI_D2, DCMI_D3, DCMI_D4, DCMI_D5, DCMI_D6, DCMI_D7, DCMI_FSIN, DCMI_HSYNC, DCMI_MISO, DCMI_MOSI, DCMI_PCLK, DCMI_PWDN, DCMI_RST, DCMI_SCL, DCMI_SCLK, DCMI_SDA, DCMI_SSEL, DCMI_VSYNC

### Notes on the sheet
- IMAGE SENSOR CONNECTOR
- 3.3V
- (near R53) 3.3V

### Library data of the parts
C32 C51 = 22UF-0805-6.3V-20%: as C6 on sheet regulators; DeviceName: -0805-6.3V-20%; LibraryName: SparkFun-Capacitors; DeviceSetName: 22UF; Part Number: CL21A226MQQNNNE
C33 C39 C40 C42 C44 C52 = CAP0402-CAP: as C3 on sheet ideal-diode; DeviceName: 0402-CAP; LibraryName: sfe; DeviceSetName: CAP; Part Number: JMK105BBJ475MV-F
J4 = DF12-36-DS: Header; GateName_1: G$1; SymbolName_1: DF12-36; LibraryName: DF12-36-DS; DeviceSetName: DF12-36-DS; MPN: DF12NB(3.0)-36DS-0.5V(51); Part Number: DF12NB(3.0)-36DS-0.5V(51)
L4 = INDUCTOR0402: InductorsBasic Inductor/Choke - 0603 and 1206. Footprints are not proven and vary greatly between part numbers.; MPN: MFBM1V1005-101-R; GateName_1: G$1; DeviceName: 0402; SymbolName_1: INDUCTOR; LibraryName: sfe; DeviceSetName: INDUCTOR; Part Number: MFBM1V1005-101-R
R24 R53 = RESISTOR0402-RES: as R14 on sheet ideal-diode; SymbolName_1: RESISTOR; DeviceName: 0402-RES; LibraryName: sfe; DeviceSetName: RESISTOR; Part Number: AC0402FR-07100KL
R27 R29 = RESISTOR0402-RES: ResistorBasic schematic elements and footprints for 0603, 1206, and PTH resistors.; MPN: AC0402FR-1310K; GateName_1: G$1; SymbolName_1: RESISTOR; DeviceName: 0402-RES; LibraryName: sfe; DeviceSetName: RESISTOR; Part Number: AC0402FR-1310K
R28 R54 = RESISTOR0402-RES: as R5 on sheet ideal-diode; SymbolName_1: RESISTOR; DeviceName: 0402-RES; LibraryName: sfe; DeviceSetName: RESISTOR; Part Number: CRCW04021K00FKEDC
R30 R31 = RESISTOR0402-RES: ResistorBasic schematic elements and footprints for 0603, 1206, and PTH resistors.; MPN: AC0402FR-074K7L; GateName_1: G$1; SymbolName_1: RESISTOR; DeviceName: 0402-RES; LibraryName: sfe; DeviceSetName: RESISTOR; Part Number: AC0402FR-074K7L

## Sheet io-headers.SchDoc
size A
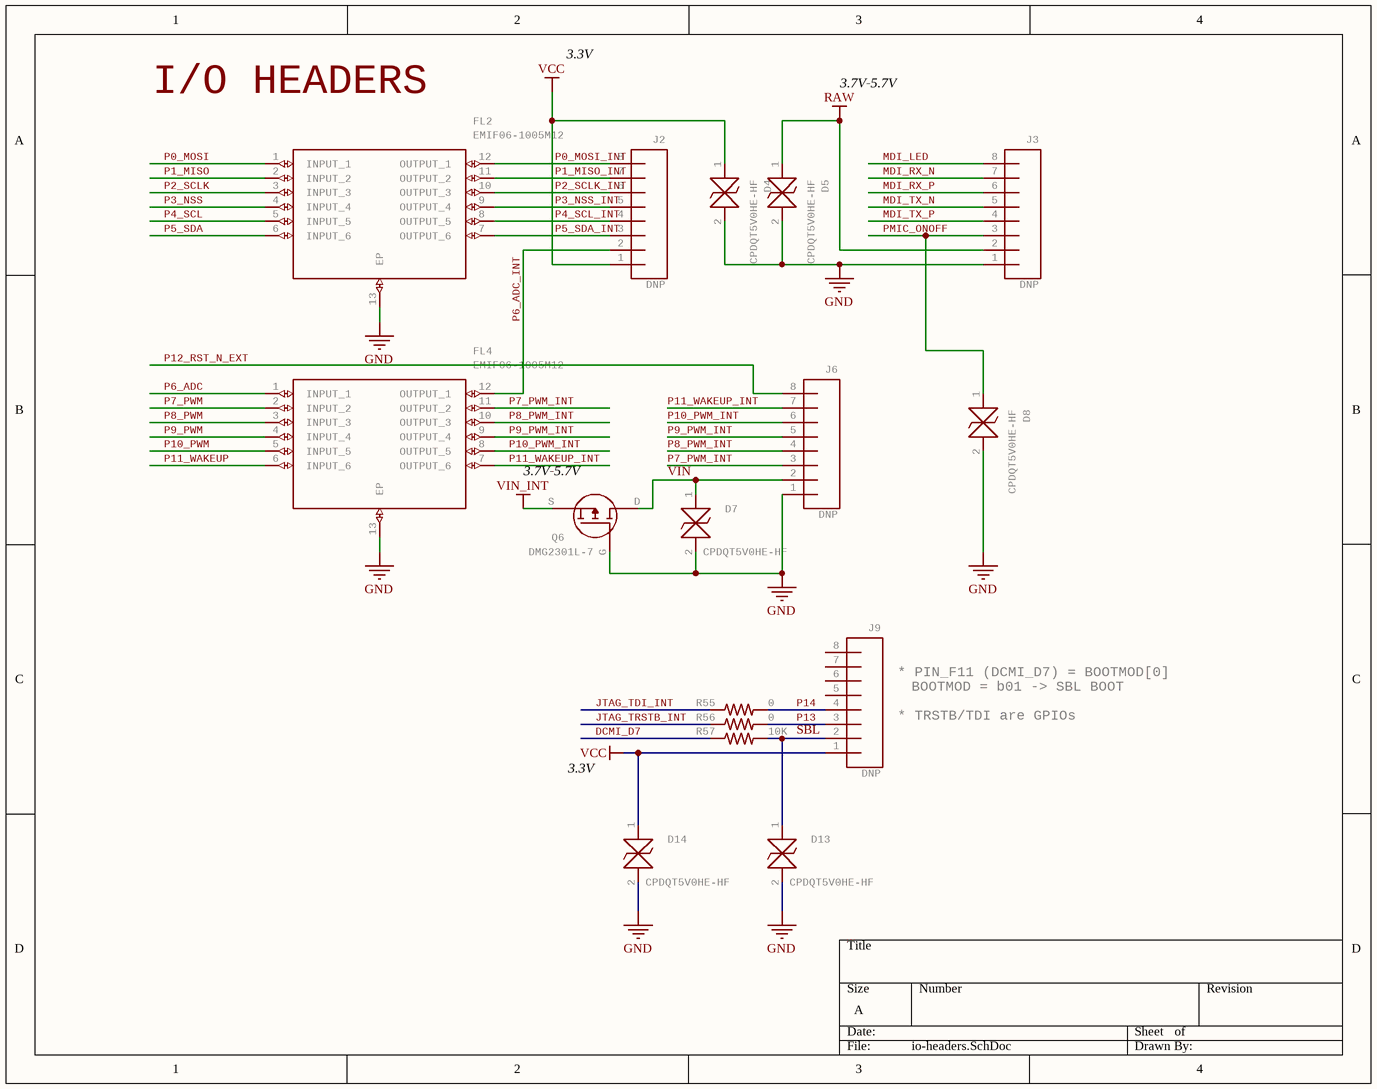
[diagram p9: io-headers.SchDoc]

### Parts
D4  CPDQT5V0HE-HF  [CPDQT5V0HEHF]
D5  CPDQT5V0HE-HF  [CPDQT5V0HEHF]
D7  CPDQT5V0HE-HF  [CPDQT5V0HEHF]
D8  CPDQT5V0HE-HF  [CPDQT5V0HEHF]
D13  CPDQT5V0HE-HF  [CPDQT5V0HEHF]
D14  CPDQT5V0HE-HF  [CPDQT5V0HEHF]
FL2  EMIF06-1005M12  [SON40P150X250X65-13N]
FL4  EMIF06-1005M12  [SON40P150X250X65-13N]
J2  DNP  [1X08]
J3  DNP  [1X08]
J6  DNP  [1X08]
J9  DNP  [1X08]
Q6  DMG2301L-7  [SOT-23-3-FET]
R55  0  [0402-RES]
R56  0  [0402-RES]
R57  10K  [0402-RES]

### Nets
GND: D4.2 D5.2 D7.2 D8.2 D13.2 D14.2 FL2.13(EP) FL4.13(EP) J3.1 J6.1 Q6.G
RAW: D5.1 J3.2
VCC: D4.1 D14.1 J2.1 J9.1
VIN_INT: Q6.S
DCMI_D7: R57.1
JTAG_TDI_INT: R55.1
JTAG_TRSTB_INT: R56.1
MDI_LED: J3.8
MDI_RX_N: J3.7
MDI_RX_P: J3.6
MDI_TX_N: J3.5
MDI_TX_P: J3.4
P0_MOSI: FL2.1(INPUT_1)
P0_MOSI_INT: FL2.12(OUTPUT_1) J2.8
P1_MISO: FL2.2(INPUT_2)
P1_MISO_INT: FL2.11(OUTPUT_2) J2.7
P2_SCLK: FL2.3(INPUT_3)
P2_SCLK_INT: FL2.10(OUTPUT_3) J2.6
P3_NSS: FL2.4(INPUT_4)
P3_NSS_INT: FL2.9(OUTPUT_4) J2.5
P4_SCL: FL2.5(INPUT_5)
P4_SCL_INT: FL2.8(OUTPUT_5) J2.4
P5_SDA: FL2.6(INPUT_6)
P5_SDA_INT: FL2.7(OUTPUT_6) J2.3
P6_ADC: FL4.1(INPUT_1)
P6_ADC_INT: FL4.12(OUTPUT_1) J2.2
P7_PWM: FL4.2(INPUT_2)
P7_PWM_INT: FL4.11(OUTPUT_2) J6.3
P8_PWM: FL4.3(INPUT_3)
P8_PWM_INT: FL4.10(OUTPUT_3) J6.4
P9_PWM: FL4.4(INPUT_4)
P9_PWM_INT: FL4.9(OUTPUT_4) J6.5
P10_PWM: FL4.5(INPUT_5)
P10_PWM_INT: FL4.8(OUTPUT_5) J6.6
P11_WAKEUP: FL4.6(INPUT_6)
P11_WAKEUP_INT: FL4.7(OUTPUT_6) J6.7
P12_RST_N_EXT: J6.8
P13: J9.3 R56.2
P14: J9.4 R55.2
PMIC_ONOFF: D8.1 J3.3
SBL: D13.1 J9.2 R57.2
VIN: D7.1 J6.2 Q6.D

Not connected (* = marked no-connect by the designer): J9 5 6 7 8

### Notes on the sheet
- I/O HEADERS
- 3.3V
- 3.7V-5.7V
- (near Q6) 3.7V-5.7V
- (near J9) * PIN_F11 (DCMI_D7) = BOOTMOD[0]
- (near J9) * TRSTB/TDI are GPIOs
- BOOTMOD = b01 -> SBL BOOT

### Library data of the parts
D4 D5 D7 D8 D13 D14 = CPDQT5V0HE-HF: as D2 on sheet battery-charging; SymbolName_1: CPDQT5V0HE-HF; LibraryName: CPDQT5V0HE-HF; DeviceSetName: CPDQT5V0HE-HF; HEIGHT: 0.42mm; MANUFACTURER_PART_NUMBER: CPDQT5V0HE-HF; MOUSER_PART_NUMBER: MOUSER_PART_NUMBER; MOUSER_PRICE-STOCK: MOUSER_PRICE-STOCK; MPN: CPDQT5V0HE-HF; Part Number: CPDQT5V0HE-HF
FL2 FL4 = EMIF06-1005M12: as FL3 on sheet sd-card; SymbolName_1: EMIF06-1005M12; LibraryName: EMIF06-1005M12; DeviceSetName: EMIF06-1005M12; HEIGHT: 0.65mm; MANUFACTURER_PART_NUMBER: EMIF06-1005M12; MOUSER_PART_NUMBER: 511-EMIF06-1005M12; MOUSER_PRICE-STOCK: https://www.mouser.co.uk/ProductDetail/STMicroelectronics/EMIF06-1005M12?qs=VJaATVMq%252BXo0u09ZqtQg3A%3D%3D; MPN: EMIF06-1005M12; Part Number: EMIF06-1005M12
J2 J3 J6 J9 = CONN_08": Multi connection point. Often used as Generic Header-pin footprint for 0.1 inch spaced/style header connections    On any of the 0.1 inch spaced packages, you can populate with these:  Break Away Headers - Straight (PRT-00116)   Break Away Male Headers - Right Angle (PRT-00553)   Female Headers (PRT-00115)   Break Away Headers - Machine Pin (PRT-00117)   Break Away Female Headers - Swiss Machine Pin (PRT-00743)   Arduino Stackable Header - 8 Pin (PRT-09279)        For SCREWTERMINALS and SPRING TERMINALS visit here:  Screw Terimnals on SparkFun.com (5mm/3.5mm/2.54mm spacing)       This device is also useful as a general connection point to wire up your design to another part of your project. Our various solder wires solder well into these plated through hole pads.  Hook-Up Wire - Assortment (Stranded, 22 AWG) (PRT-11375)   Hook-Up Wire - Assortment (Solid Core, 22 AWG) (PRT-11367)   View the entire wire category on our website here          Special notes:     Molex polarized connector foot print use with SKU : PRT-08231 with associated crimp pins and housings. 1MM SMD Version SKU: PRT-10208    NOTES ON THE VARIANTS LOCK and LOCK_LONGPADS... This footprint was designed to help hold the alignment of a through-hole component (i.e.  6-pin header) while soldering it into place. You may notice that each hole has been shifted either up or down by 0.005 of an inch from it's more standard position (which is a perfectly straight line).  This slight alteration caused the pins (the squares in the middle) to touch the edges of the holes.  Because they are alternating, it causes a "brace" to hold the component in place.  0.005 has proven to be the perfect amount of "off-center" position when using our standard breakaway headers. Although looks a little odd when you look at the bare footprint, once you have a header in there, the alteration is very hard to notice.  Also,if you push a header all the way into place, it is covered up entirely on the bottom side.; GateName_1: G$1; DeviceName: "; POPULATE: 0; PROD_ID: CONN-08438; SymbolName_1: CONN_08; LibraryName: SparkFun-Connectors; DeviceSetName: CONN_08; MPN: DNP; Part Number: DNP
Q6 = DMG2301L-7: GateName_1: G$1; HEIGHT: 1.1mm; MPN: DMG2301L-7; Part Number: DMG2301L-7
R55 R56 = RESISTOR0402-RES: ResistorBasic schematic elements and footprints for 0603, 1206, and PTH resistors.; MPN: RC0402JR-070R; GateName_1: G$1; SymbolName_1: RESISTOR; DeviceName: 0402-RES; LibraryName: sfe; DeviceSetName: RESISTOR; Part Number: RC0402JR-070R
R57 = RESISTOR0402-RES: as R27 on sheet sensor-header; SymbolName_1: RESISTOR; DeviceName: 0402-RES; LibraryName: sfe; DeviceSetName: RESISTOR; Part Number: AC0402FR-1310K

## Sheet jtag.SchDoc
size A
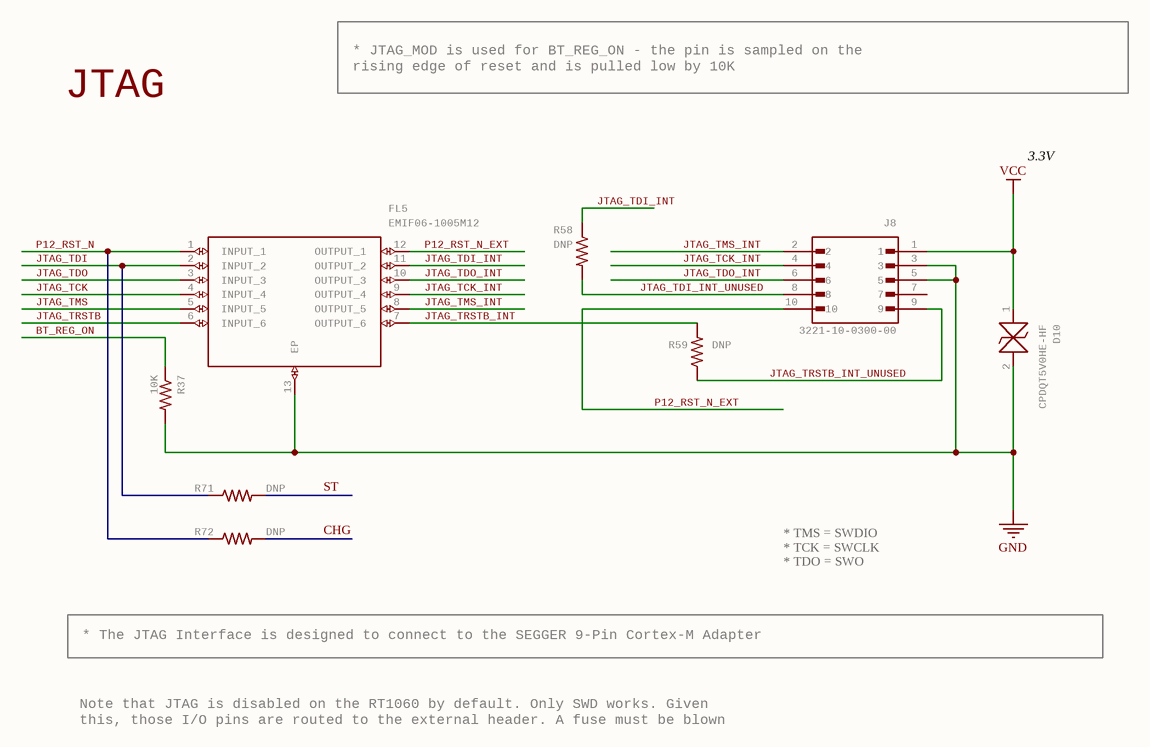
[diagram p10: jtag.SchDoc]

### Parts
D10  CPDQT5V0HE-HF  [CPDQT5V0HEHF]
FL5  EMIF06-1005M12  [SON40P150X250X65-13N]
J8  3221-10-0300-00  [CNC_3221-10-0300-00]
R37  10K  [0402-RES]
R58  DNP  [0402-RES]
R59  DNP  [0402-RES]
R71  DNP  [0402-RES]
R72  DNP  [0402-RES]

### Nets
GND: D10.2 FL5.13(EP) J8.3 J8.5 R37.2
VCC: D10.1 J8.1
BT_REG_ON: R37.1
CHG: R72.2
JTAG_TCK: FL5.4(INPUT_4)
JTAG_TCK_INT: FL5.9(OUTPUT_4) J8.4
JTAG_TDI: FL5.2(INPUT_2) R71.1
JTAG_TDI_INT: FL5.11(OUTPUT_2) R58.1
JTAG_TDI_INT_UNUSED: J8.8 R58.2
JTAG_TDO: FL5.3(INPUT_3)
JTAG_TDO_INT: FL5.10(OUTPUT_3) J8.6
JTAG_TMS: FL5.5(INPUT_5)
JTAG_TMS_INT: FL5.8(OUTPUT_5) J8.2
JTAG_TRSTB: FL5.6(INPUT_6)
JTAG_TRSTB_INT: FL5.7(OUTPUT_6) R59.2
JTAG_TRSTB_INT_UNUSED: J8.9 R59.1
P12_RST_N: FL5.1(INPUT_1) R72.1
P12_RST_N_EXT: FL5.12(OUTPUT_1) J8.10
ST: R71.2

Not connected (* = marked no-connect by the designer): J8 7

### Notes on the sheet
- * JTAG_MOD is used for BT_REG_ON - the pin is sampled on the
  rising edge of reset and is pulled low by 10K
- JTAG
- 3.3V
- * The JTAG Interface is designed to connect to the SEGGER 9-Pin Cortex-M Adapter
- * TMS = SWDIO
  * TCK = SWCLK
  * TDO = SWO
- Note that JTAG is disabled on the RT1060 by default. Only SWD works. Given this, those I/O pins are routed to the external header. A fuse must be blown to switch to JTAG which disables SWD

### Library data of the parts
D10 = CPDQT5V0HE-HF: as D2 on sheet battery-charging; SymbolName_1: CPDQT5V0HE-HF; LibraryName: CPDQT5V0HE-HF; DeviceSetName: CPDQT5V0HE-HF; HEIGHT: 0.42mm; MANUFACTURER_PART_NUMBER: CPDQT5V0HE-HF; MOUSER_PART_NUMBER: MOUSER_PART_NUMBER; MOUSER_PRICE-STOCK: MOUSER_PRICE-STOCK; MPN: CPDQT5V0HE-HF; Part Number: CPDQT5V0HE-HF
FL5 = EMIF06-1005M12: as FL3 on sheet sd-card; SymbolName_1: EMIF06-1005M12; LibraryName: EMIF06-1005M12; DeviceSetName: EMIF06-1005M12; HEIGHT: 0.65mm; MANUFACTURER_PART_NUMBER: EMIF06-1005M12; MOUSER_PART_NUMBER: 511-EMIF06-1005M12; MOUSER_PRICE-STOCK: https://www.mouser.co.uk/ProductDetail/STMicroelectronics/EMIF06-1005M12?qs=VJaATVMq%252BXo0u09ZqtQg3A%3D%3D; MPN: EMIF06-1005M12; Part Number: EMIF06-1005M12
J8 = 3221-10-0300-00: Check availability; GateName_1: G$1; MF: CNC Tech; SymbolName_1: 3221-10-0300-00; LibraryName: 3221-10-0300-00; DeviceSetName: 3221-10-0300-00; AVAILABILITY: In Stock; MP: 3221-10-0300-00; MPN: 3221-10-0300-00; PACKAGE: None; PRICE: None; PURCHASE-URL: https://pricing.snapeda.com/search/part/3221-10-0300-00/?ref=eda; Part Number: 3221-10-0300-00
R37 = RESISTOR0402-RES: as R4 on sheet battery-charging; SymbolName_1: RESISTOR; DeviceName: 0402-RES; LibraryName: sfe; DeviceSetName: RESISTOR; Part Number: AC0402FR-1310KL
R58 R59 R71 R72 = RESISTOR0402-RES: ResistorBasic schematic elements and footprints for 0603, 1206, and PTH resistors.; GateName_1: G$1; SymbolName_1: RESISTOR; DeviceName: 0402-RES; LibraryName: sfe; DeviceSetName: RESISTOR; MPN: DNP; Part Number: DNP

## Sheet ethernet.SchDoc
size A
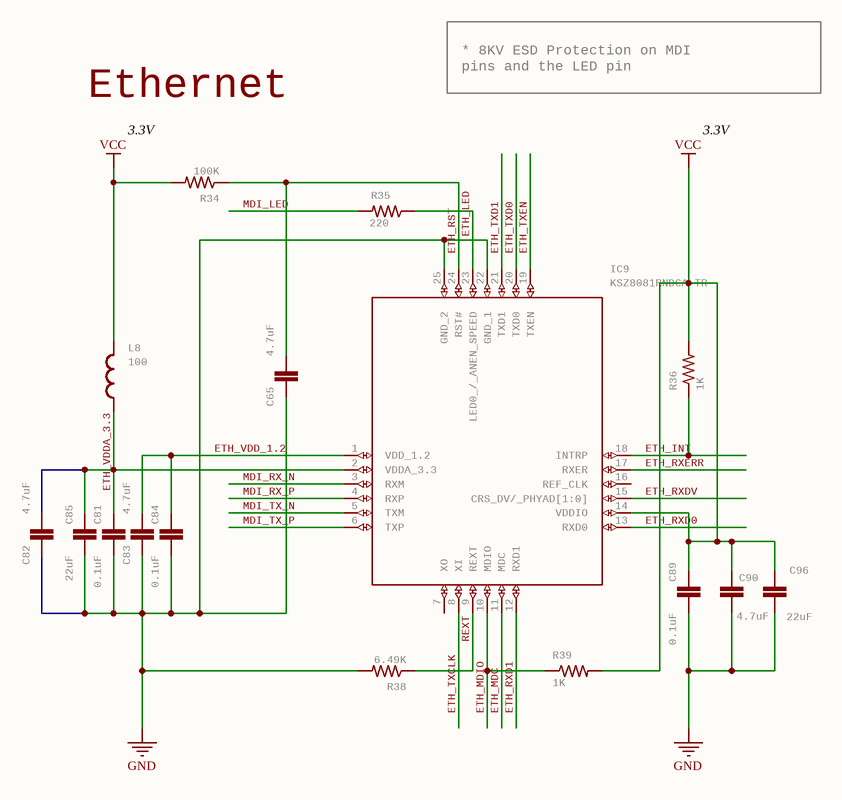
[diagram p11: ethernet.SchDoc]

### Parts
C65  4.7uF  [0402-CAP]
C81  0.1uF  [0402-CAP]
C82  4.7uF  [0402-CAP]
C83  4.7uF  [0402-CAP]
C84  0.1uF  [0402-CAP]
C85  22uF  [0805]
C89  0.1uF  [0402-CAP]
C90  4.7uF  [0402-CAP]
C96  22uF  [0805]
IC9  KSZ8081RNDCA-TR  [QFN50P400X400X90-25N]
L8  100  [C0402]
R34  100K  [0402-RES]
R35  220  [0402-RES]
R36  1K  [0402-RES]
R38  6.49K  [0402-RES]
R39  1K  [0402-RES]

### Nets
GND: C65.1 C81.2 C82.1 C83.1 C84.2 C85.2 C89.2 C90.1 C96.2 IC9.22(GND_1) IC9.25(GND_2) R38.2
VCC: C89.1 C90.2 C96.1 IC9.14(VDDIO) L8.2 R34.2 R36.2 R39.2
ETH_INT: IC9.18(INTRP) R36.1
ETH_LED: IC9.23(LED0_/_ANEN_SPEED) R35.1
ETH_MDC: IC9.11(MDC)
ETH_MDIO: IC9.10(MDIO) R39.1
ETH_RST: C65.2 IC9.24(RST#) R34.1
ETH_RXD0: IC9.13(RXD0)
ETH_RXD1: IC9.12(RXD1)
ETH_RXDV: IC9.15(CRS_DV/_PHYAD[1:0])
ETH_RXERR: IC9.17(RXER)
ETH_TXCLK: IC9.8(XI)
ETH_TXD0: IC9.20(TXD0)
ETH_TXD1: IC9.21(TXD1)
ETH_TXEN: IC9.19(TXEN)
ETH_VDD_1.2: C83.2 C84.1 IC9.1(VDD_1.2)
ETH_VDDA_3.3: C81.1 C82.2 C85.1 IC9.2(VDDA_3.3) L8.1
MDI_LED: R35.2
MDI_RX_N: IC9.3(RXM)
MDI_RX_P: IC9.4(RXP)
MDI_TX_N: IC9.5(TXM)
MDI_TX_P: IC9.6(TXP)
REXT: IC9.9(REXT) R38.1

Not connected (* = marked no-connect by the designer): IC9 7(XO) 16(REF_CLK)

### Notes on the sheet
- * 8KV ESD Protection on MDI
  pins and the LED pin
- Ethernet
- (near R34) 3.3V
- 3.3V

### Library data of the parts
C65 C82 C83 C90 = CAP0402-CAP: as C3 on sheet ideal-diode; DeviceName: 0402-CAP; LibraryName: sfe; DeviceSetName: CAP; Part Number: JMK105BBJ475MV-F
C81 C84 C89 = C-EUC0201: as C22 on sheet qspi-flash; LibraryName: rcl; DeviceSetName: C-EU; SPICEPREFIX: C; Part Number: C0402C104Z4VAC
C85 C96 = 22UF-0805-6.3V-20%: as C6 on sheet regulators; DeviceName: -0805-6.3V-20%; LibraryName: SparkFun-Capacitors; DeviceSetName: 22UF; Part Number: CL21A226MQQNNNE
IC9 = KSZ8081RNDCA-TR: Ethernet ICs 10/100 BASE-TX Physical Layer Transceiver   Source:  Datasheet; MANUFACTURER_NAME: Microchip; GateName_1: G$1; SymbolName_1: KSZ8081RNDCA-TR; LibraryName: KSZ8081RNDCA-TR; DeviceSetName: KSZ8081RNDCA-TR; HEIGHT: 0.9mm; MANUFACTURER_PART_NUMBER: KSZ8081RNDCA-TR; MOUSER_PART_NUMBER: 998-KSZ8081RNDCATR; MOUSER_PRICE-STOCK: https://www.mouser.co.uk/ProductDetail/Microchip-Technology-Atmel/KSZ8081RNDCA-TR?qs=U6T8BxXiZAXLXXdn%2FieQKw%3D%3D; MPN: KSZ8081RNDCA-TR; Part Number: KSZ8081RNDCA-TR
L8 = INDUCTOR0402: as L4 on sheet sensor-header; SymbolName_1: INDUCTOR; LibraryName: sfe; DeviceSetName: INDUCTOR; Part Number: MFBM1V1005-101-R
R34 = RESISTOR0402-RES: as R14 on sheet ideal-diode; SymbolName_1: RESISTOR; DeviceName: 0402-RES; LibraryName: sfe; DeviceSetName: RESISTOR; Part Number: AC0402FR-07100KL
R35 = RESISTOR0402-RES: ResistorBasic schematic elements and footprints for 0603, 1206, and PTH resistors.; MPN: CRGCQ0402F220R; GateName_1: G$1; SymbolName_1: RESISTOR; DeviceName: 0402-RES; LibraryName: sfe; DeviceSetName: RESISTOR; Part Number: CRGCQ0402F220R
R36 R39 = RESISTOR0402-RES: as R5 on sheet ideal-diode; SymbolName_1: RESISTOR; DeviceName: 0402-RES; LibraryName: sfe; DeviceSetName: RESISTOR; Part Number: CRCW04021K00FKEDC
R38 = RESISTOR0402-RES: ResistorBasic schematic elements and footprints for 0603, 1206, and PTH resistors.; MPN: CR0402-FX-6491GLF; GateName_1: G$1; SymbolName_1: RESISTOR; DeviceName: 0402-RES; LibraryName: sfe; DeviceSetName: RESISTOR; Part Number: CR0402-FX-6491GLF

## Sheet wifi-bt.SchDoc
size A
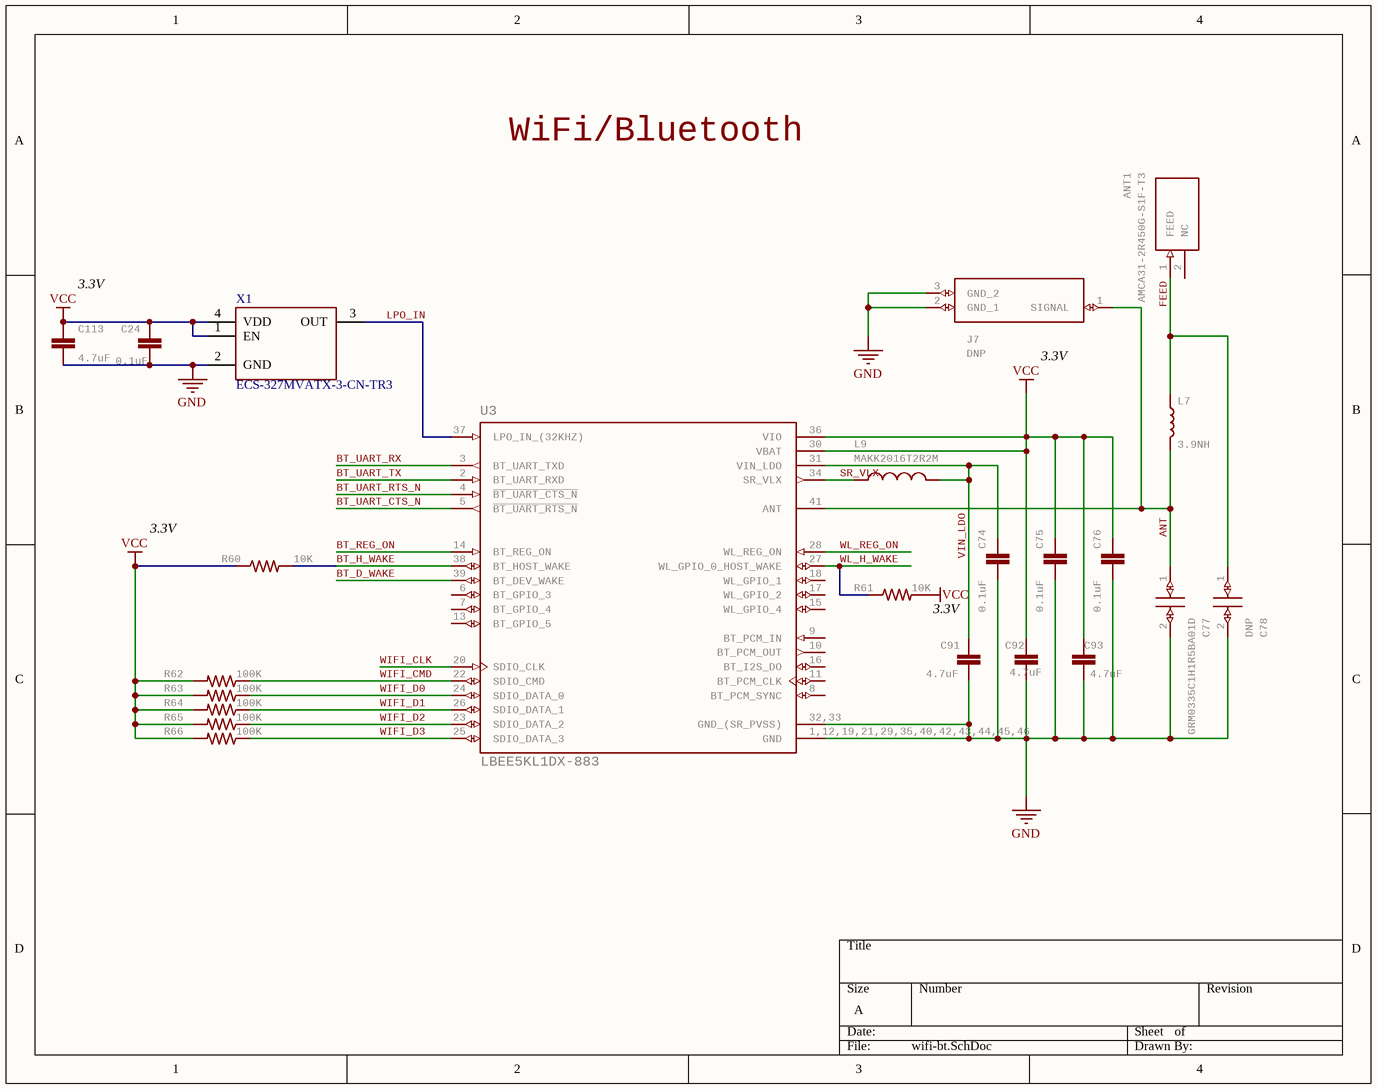
[diagram p12: wifi-bt.SchDoc]

### Parts
ANT1  AMCA31-2R450G-S1F-T3  [ANTC3216X140N]
C24  0.1uF  [0402-CAP]
C74  0.1uF  [0402-CAP]
C75  0.1uF  [0402-CAP]
C76  0.1uF  [0402-CAP]
C77  GRM0335C1H1R5BA01D  [CAPC0603X33N]
C78  DNP  [C0201-NO-3D]
C91  4.7uF  [0402-CAP]
C92  4.7uF  [0402-CAP]
C93  4.7uF  [0402-CAP]
C113  4.7uF  [0402-CAP]
J7  DNP  [23370191-NO-3D]
L7  3.9NH  [0402]
L9  MAKK2016T2R2M  [INDC2016X100N]
R60  10K  [0402-RES]
R61  10K  [0402-RES]
R62  100K  [0402-RES]
R63  100K  [0402-RES]
R64  100K  [0402-RES]
R65  100K  [0402-RES]
R66  100K  [0402-RES]
U3  LBEE5KL1DX-883  [XCVR_LBEE5KL1DX-TEMP]
X1  ECS-327MVATX-3-CN-TR3  [XTAL_3225]

### Nets
GND: C24.2 C74.2 C75.2 C76.2 C77.2 C78.2 C91.1 C92.1 C93.1 C113.1 J7.2(GND_1) J7.3(GND_2) U3.1,12,19,21,29,35,40,42,43,44,45,46(GND) U3.32,33(GND_(SR_PVSS)) X1.2(GND)
VCC: C24.1 C75.1 C76.1 C92.2 C93.2 C113.2 R60.1 R61.2 R62.2 R63.2 R64.2 R65.2 R66.2 U3.30(VBAT) U3.36(VIO) X1.1(EN) X1.4(VDD)
ANT: C77.1 J7.1(SIGNAL) L7.2 U3.41(ANT)
BT_D_WAKE: U3.39(BT_DEV_WAKE)
BT_H_WAKE: R60.2 U3.38(BT_HOST_WAKE)
BT_REG_ON: U3.14(BT_REG_ON)
BT_UART_CTS_N: U3.5(~{BT_UART_RTS_N})
BT_UART_RTS_N: U3.4(~{BT_UART_CTS_N})
BT_UART_RX: U3.3(BT_UART_TXD)
BT_UART_TX: U3.2(BT_UART_RXD)
FEED: ANT1.1(FEED) C78.1 L7.1
LPO_IN: U3.37(LPO_IN_(32KHZ)) X1.3(OUT)
SR_VLX: L9.1 U3.34(SR_VLX)
VIN_LDO: C74.1 C91.2 L9.2 U3.31(VIN_LDO)
WIFI_CLK: U3.20(SDIO_CLK)
WIFI_CMD: R62.1 U3.22(SDIO_CMD)
WIFI_D0: R63.1 U3.24(SDIO_DATA_0)
WIFI_D1: R64.1 U3.26(SDIO_DATA_1)
WIFI_D2: R65.1 U3.23(SDIO_DATA_2)
WIFI_D3: R66.1 U3.25(SDIO_DATA_3)
WL_H_WAKE: R61.1 U3.27(WL_GPIO_0_HOST_WAKE)
WL_REG_ON: U3.28(WL_REG_ON)

Not connected (* = marked no-connect by the designer): ANT1 2(NC); U3 6(BT_GPIO_3) 7(BT_GPIO_4) 8(BT_PCM_SYNC) 9(BT_PCM_IN) 10(BT_PCM_OUT) 11(BT_PCM_CLK) 13(BT_GPIO_5) 15(WL_GPIO_4) 16(BT_I2S_DO) 17(WL_GPIO_2) 18(WL_GPIO_1)

### Notes on the sheet
- WiFi/Bluetooth
- 3.3V
- (near J7) 3.3V

### Library data of the parts
ANT1 = AMCA31-2R450G-S1F-T3: ABRACON - AMCA31-2R450G-S1F-T3 - ANTENNA, CHIP, 2.45GHZ, 50 OHM, 1206   Source:  Datasheet; GateName_1: G$1; SymbolName_1: AMCA31-2R450G-S1F-T3; LibraryName: AMCA31-2R450G-S1F-T3; DeviceSetName: AMCA31-2R450G-S1F-T3; HEIGHT: 1.4mm; MANUFACTURER_NAME: ABRACON; MANUFACTURER_PART_NUMBER: AMCA31-2R450G-S1F-T3; MOUSER_PART_NUMBER: 815-CA312R450GS1FT3; MOUSER_PRICE-STOCK: https://www.mouser.co.uk/ProductDetail/ABRACON/AMCA31-2R450G-S1F-T3?qs=AAveGqk956GLuOddQEK40Q%3D%3D; MPN: AMCA31-2R450G-S1F-T3; Part Number: AMCA31-2R450G-S1F-T3
C24 C74-C76 = C-EUC0201: as C22 on sheet qspi-flash; LibraryName: rcl; DeviceSetName: C-EU; SPICEPREFIX: C; Part Number: C0402C104Z4VAC
C77 = GRM0335C1H1R5BA01D: Chip Capacitor value 1R5   Source:  Datasheet; MANUFACTURER_NAME: Murata Electronics; GateName_1: G$1; SymbolName_1: GRM0335C1H1R5BA01D; LibraryName: GRM0335C1H1R5BA01D; DeviceSetName: GRM0335C1H1R5BA01D; HEIGHT: 0.33mm; MANUFACTURER_PART_NUMBER: GRM0335C1H1R5BA01D; MOUSER_PART_NUMBER: 81-GRM0335C1H1R5BA1D; MOUSER_PRICE-STOCK: https://www.mouser.co.uk/ProductDetail/Murata-Electronics/GRM0335C1H1R5BA01D?qs=7vGxPDjevFPFqveGwv%252BPUQ%3D%3D; MPN: GRM0335C1H1R5BA01D; Part Number: GRM0335C1H1R5BA01D
C78 = GRM0335C1H1R5BA01D: Chip Capacitor value 1R5   Source:  Datasheet; MANUFACTURER_NAME: Murata Electronics; GateName_1: G$1; POPULATE: 0; SymbolName_1: GRM0335C1H1R5BA01D; LibraryName: GRM0335C1H1R5BA01D; DeviceSetName: GRM0335C1H1R5BA01D; HEIGHT: 0.33mm; MANUFACTURER_PART_NUMBER: GRM0335C1H1R5BA01D; MOUSER_PART_NUMBER: 81-GRM0335C1H1R5BA1D; MOUSER_PRICE-STOCK: https://www.mouser.co.uk/ProductDetail/Murata-Electronics/GRM0335C1H1R5BA01D?qs=7vGxPDjevFPFqveGwv%252BPUQ%3D%3D; MPN: DNP; Part Number: DNP
C91-C93 C113 = CAP0402-CAP: as C3 on sheet ideal-diode; DeviceName: 0402-CAP; LibraryName: sfe; DeviceSetName: CAP; Part Number: JMK105BBJ475MV-F
J7 = 2337019-1: RF Connectors / Coaxial Connectors MicroCoax receptacle UMCC Gen 1   Source:  Datasheet; MANUFACTURER_NAME: TE Connectivity; GateName_1: G$1; POPULATE: 0; SymbolName_1: 2337019-1; LibraryName: 2337019-1; DeviceSetName: 2337019-1; HEIGHT: 1.4mm; MANUFACTURER_PART_NUMBER: 2337019-1; MOUSER_PART_NUMBER: 571-2337019-1; MOUSER_PRICE-STOCK: https://www.mouser.co.uk/ProductDetail/TE-Connectivity/2337019-1?qs=l4Gc20tDgJIuN7nS9rJkJw%3D%3D; MPN: 2337019-1; Part Number: 2337019-1
L7 = INDUCTOR-0402-3.9NH: Inductors    Resist changes in electrical current. Basically a coil of wire.   SparkFun Products:  SparkFun Load Cell Amplifier - HX711  IOIO-OTG - V2.2; MPN: L-07C3N9SV6T; GateName_1: G$1; PROD_ID: NDUC-13457; SymbolName_1: INDUCTOR; DeviceName: -0402-3.9NH; LibraryName: SparkFun-Coils; DeviceSetName: INDUCTOR; Part Number: L-07C3N9SV6T
L9 = MAKK2016T2R2M: INDUCTOR, METAL CORE Check availability; GateName_1: G$1; MF: Taiyo Yuden; SymbolName_1: MAKK2016T2R2M; LibraryName: MAKK2016T2R2M; DeviceSetName: MAKK2016T2R2M; AVAILABILITY: In Stock; MP: MAKK2016T2R2M; MPN: MAKK2016T2R2M; PACKAGE: 2016 Taiyo Yuden; PRICE: None; PURCHASE-URL: https://pricing.snapeda.com/search/part/MAKK2016T2R2M/?ref=eda; Part Number: MAKK2016T2R2M
R60 R61 = RESISTOR0402-RES: as R27 on sheet sensor-header; SymbolName_1: RESISTOR; DeviceName: 0402-RES; LibraryName: sfe; DeviceSetName: RESISTOR; Part Number: AC0402FR-1310K
R62-R66 = RESISTOR0402-RES: as R14 on sheet ideal-diode; SymbolName_1: RESISTOR; DeviceName: 0402-RES; LibraryName: sfe; DeviceSetName: RESISTOR; Part Number: AC0402FR-07100KL
U3 = LBEE5KL1DX-TEMP: Broadcom Chipset for 802.11b/g/n + Bluetooth 4.1/EDR; GateName_1: G$1; MF: Murata Electronics; SymbolName_1: LBEE5KL1DX-TEMP; LibraryName: LBEE5KL1DX-TEMP; DeviceSetName: LBEE5KL1DX-TEMP; AVAILABILITY: Unavailable; MP: LBEE5KL1DX-TEMP; MPN: LBEE5KL1DX-883; PACKAGE: None; PRICE: None; Part Number: LBEE5KL1DX-883
X1 = ECS-327MVATX-3-CN-TR3: Part Number: ECS-327MVATX-3-CN-TR3; MPN: ECS-327MVATX-3-CN-TR3